# EAGLE schematic urdevboard (EAGLE 5.06), part 1 of 2
POWER: 0.2W; VOLT: 25V

## Sheet 1 of 16
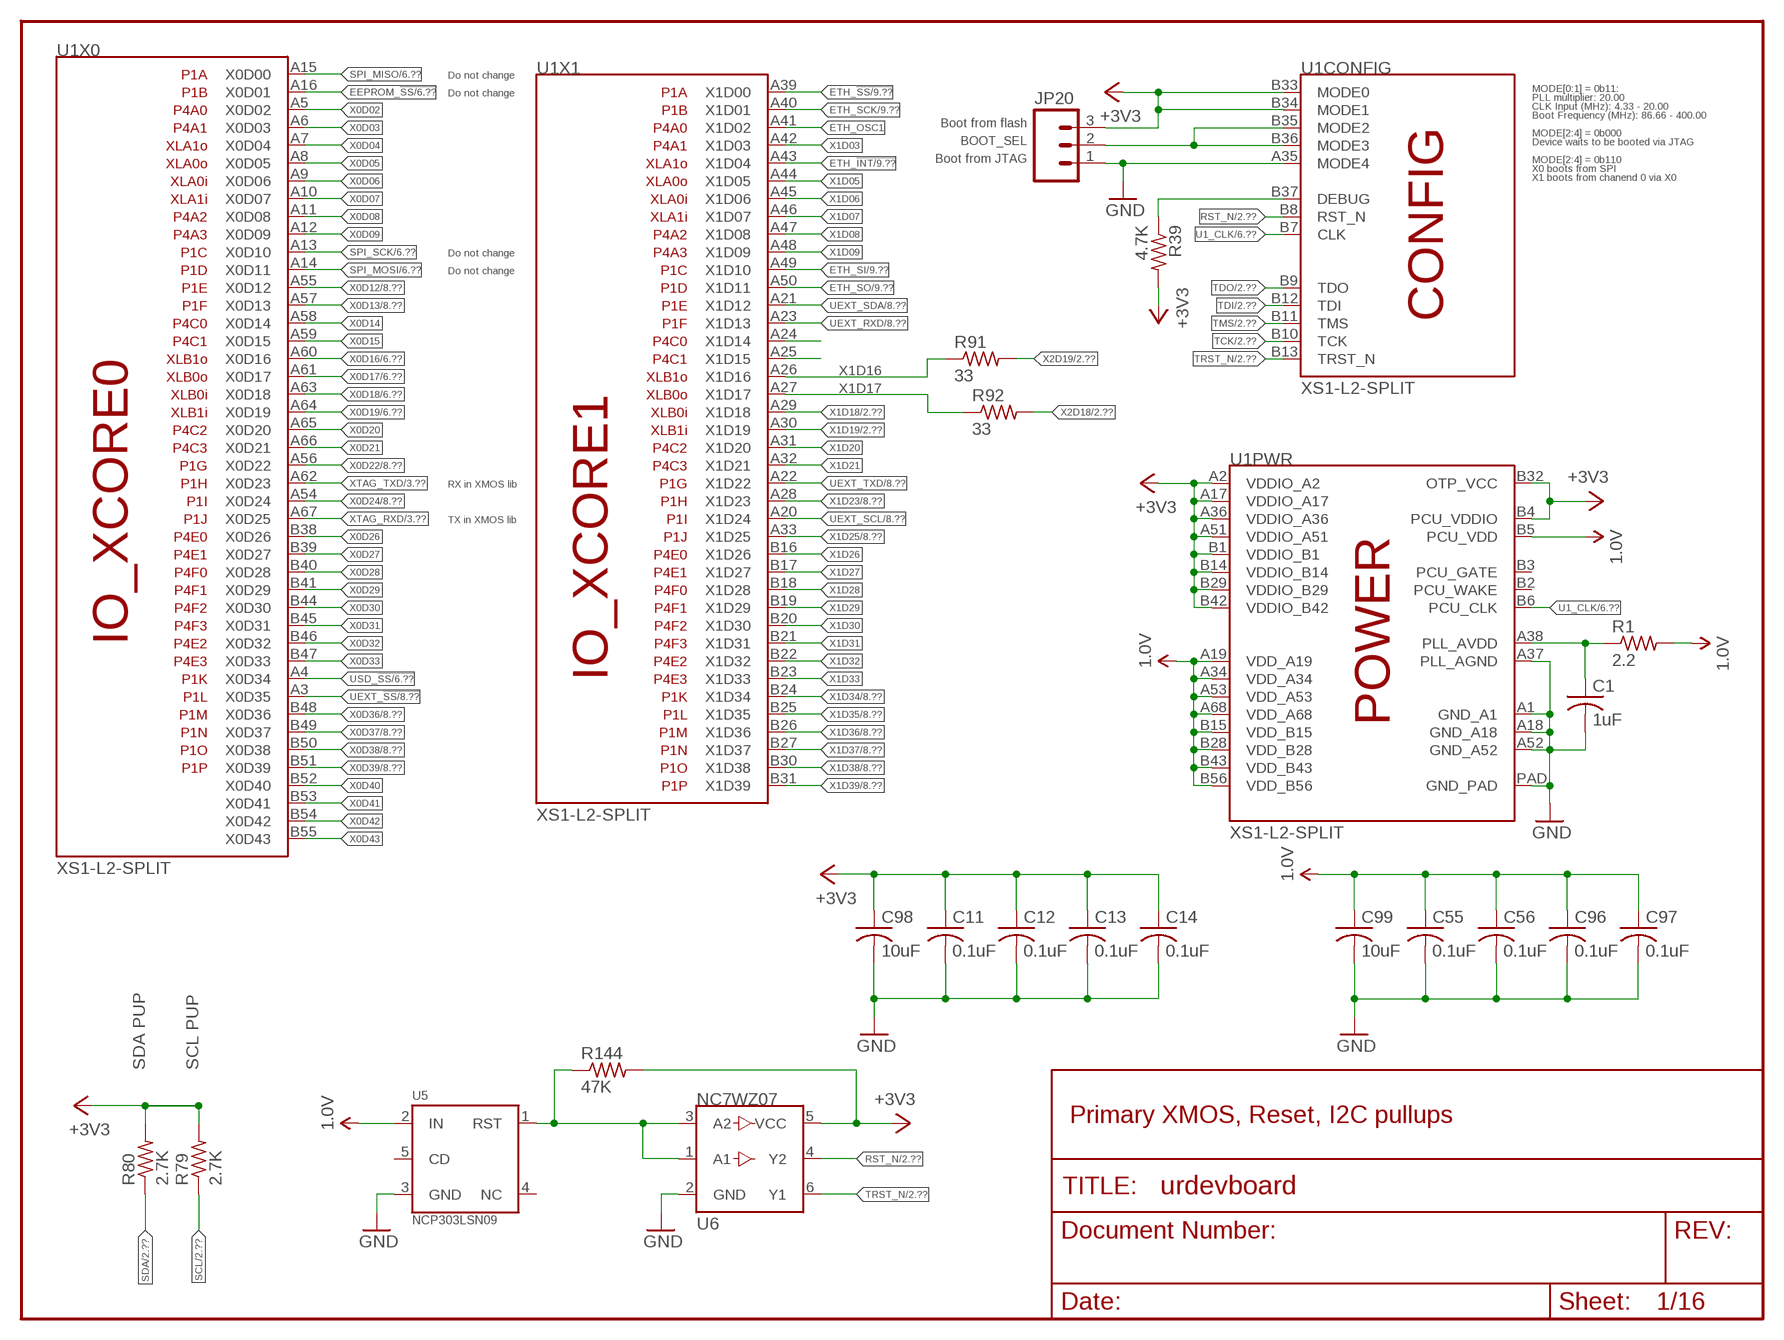
[diagram p0: schematic, sheet 1]

### Parts
C1  1uF  C-USC0402  [C0402]
C11  0.1uF  C-USC0402  [C0402]
C12  0.1uF  C-USC0402  [C0402]
C13  0.1uF  C-USC0402  [C0402]
C14  0.1uF  C-USC0402  [C0402]
C55  0.1uF  C-USC0402  [C0402]
C56  0.1uF  C-USC0402  [C0402]
C96  0.1uF  C-USC0402  [C0402]
C97  0.1uF  C-USC0402  [C0402]
C98  10uF  C-USC0805  [C0805]
C99  10uF  C-USC0805  [C0805]
JP20  M03PTH  [1X03]
R1  2.2  R-US_R0402  [R0402]
R39  4.7K  R-US_R0603  [R0603]
R79  2.7K  R-US_R0603  [R0603]
R80  2.7K  R-US_R0603  [R0603]
R91  33  R-US_R0402  [R0402]
R92  33  R-US_R0402  [R0402]
R144  47K  R-US_R0402  [R0402]
U1  XS1-L2-SPLIT  [124QFN]
U5  NCP303LSN09  [SOT23-5]
U6  NC7WZ07  [SC70-6]

### Nets
1.0V: C55.1 C56.1 C96.1 C97.1 C99.1 R1.2 U1.A19(PWR:VDD_A19) U1.A34(PWR:VDD_A34) U1.A53(PWR:VDD_A53) U1.A68(PWR:VDD_A68) U1.B5(PWR:PCU_VDD) U1.B15(PWR:VDD_B15) U1.B28(PWR:VDD_B28) U1.B43(PWR:VDD_B43) U1.B56(PWR:VDD_B56) U5.2(IN) ; also sheet 2,7
+3V3: C11.1 C12.1 C13.1 C14.1 C98.1 JP20.3 R39.2 R79.2 R80.2 R144.2 U1.A2(PWR:VDDIO_A2) U1.A17(PWR:VDDIO_A17) U1.A36(PWR:VDDIO_A36) U1.A51(PWR:VDDIO_A51) U1.B1(PWR:VDDIO_B1) U1.B4(PWR:PCU_VDDIO) U1.B14(PWR:VDDIO_B14) U1.B29(PWR:VDDIO_B29) U1.B32(PWR:OTP_VCC) U1.B33(CONFIG:MODE0) U1.B34(CONFIG:MODE1) U1.B42(PWR:VDDIO_B42) U6.5(VCC) ; also sheet 2,3,4,5,6,7,8,9,10,11,16
BOOT_SEL: JP20.2 U1.B35(CONFIG:MODE2) U1.B36(CONFIG:MODE3)
DEBUG_N: R39.1 U1.B37(CONFIG:DEBUG) ; also sheet 2,3,6
EEPROM_!SS: U1.A16(X0:X0D01) ; also sheet 6
ETH_!INT: U1.A43(X1:X1D04) ; also sheet 9
ETH_!SS: U1.A39(X1:X1D00) ; also sheet 9
ETH_OSC1: U1.A41(X1:X1D02) ; also sheet 9
ETH_SCK: U1.A40(X1:X1D01) ; also sheet 9
ETH_SI: U1.A49(X1:X1D10) ; also sheet 9
ETH_SO: U1.A50(X1:X1D11) ; also sheet 9
GND: C1.2 C11.2 C12.2 C13.2 C14.2 C55.2 C56.2 C96.2 C97.2 C98.2 C99.2 JP20.1 U1.A1(PWR:GND_A1) U1.A18(PWR:GND_A18) U1.A35(CONFIG:MODE4) U1.A37(PWR:PLL_AGND) U1.A52(PWR:GND_A52) U1.PAD(PWR:GND_PAD) U5.3(GND) U6.2(GND) ; also sheet 2,3,4,5,6,7,8,9,10,11,12,13,14,15,16
RST_N: U1.B8(CONFIG:RST_N) U6.4(Y2) ; also sheet 2,3,6
RST_OUT: R144.1 U5.1(RST) U6.1(A1) U6.3(A2)
SCL: R79.1 ; also sheet 2,8,11
SDA: R80.1 ; also sheet 2,8,11
SPI_MISO: U1.A15(X0:X0D00) ; also sheet 6,8
SPI_MOSI: U1.A14(X0:X0D11) ; also sheet 6,8
SPI_SCK: U1.A13(X0:X0D10) ; also sheet 6,8
TCK: U1.B10(CONFIG:TCK) ; also sheet 2,3,6
TDI: U1.B12(CONFIG:TDI) ; also sheet 2,3,6
TDO: U1.B9(CONFIG:TDO) ; also sheet 2,3,6
TMS: U1.B11(CONFIG:TMS) ; also sheet 2,3,6
TRST_N: U1.B13(CONFIG:TRST_N) U6.6(Y1) ; also sheet 2,3,6
U1_CLK: U1.B6(PWR:PCU_CLK) U1.B7(CONFIG:CLK) ; also sheet 6
U1_PLL_AVDD: C1.1 R1.1 U1.A38(PWR:PLL_AVDD)
UEXT_!SS: U1.A3(X0:X0D35) ; also sheet 8
UEXT_RXD: U1.A23(X1:X1D13) ; also sheet 8
UEXT_SCL: U1.A20(X1:X1D24) ; also sheet 8
UEXT_SDA: U1.A21(X1:X1D12) ; also sheet 8
UEXT_TXD: U1.A22(X1:X1D22) ; also sheet 8
USD_!SS: U1.A4(X0:X0D34) ; also sheet 6
X0D02: U1.A5(X0:X0D02)
X0D03: U1.A6(X0:X0D03)
X0D04: U1.A7(X0:X0D04)
X0D05: U1.A8(X0:X0D05)
X0D06: U1.A9(X0:X0D06)
X0D07: U1.A10(X0:X0D07)
X0D08: U1.A11(X0:X0D08)
X0D09: U1.A12(X0:X0D09)
X0D12: U1.A55(X0:X0D12) ; also sheet 8
X0D13: U1.A57(X0:X0D13) ; also sheet 8
X0D14: U1.A58(X0:X0D14)
X0D15: U1.A59(X0:X0D15)
X0D16: U1.A60(X0:X0D16) ; also sheet 6
X0D17: U1.A61(X0:X0D17) ; also sheet 6
X0D18: U1.A63(X0:X0D18) ; also sheet 6
X0D19: U1.A64(X0:X0D19) ; also sheet 6
X0D20: U1.A65(X0:X0D20)
X0D21: U1.A66(X0:X0D21)
X0D22: U1.A56(X0:X0D22) ; also sheet 8
X0D24: U1.A54(X0:X0D24) ; also sheet 8
X0D26: U1.B38(X0:X0D26)
X0D27: U1.B39(X0:X0D27)
X0D28: U1.B40(X0:X0D28)
X0D29: U1.B41(X0:X0D29)
X0D30: U1.B44(X0:X0D30)
X0D31: U1.B45(X0:X0D31)
X0D32: U1.B46(X0:X0D32)
X0D33: U1.B47(X0:X0D33)
X0D36: U1.B48(X0:X0D36) ; also sheet 8
X0D37: U1.B49(X0:X0D37) ; also sheet 8
X0D38: U1.B50(X0:X0D38) ; also sheet 8
X0D39: U1.B51(X0:X0D39) ; also sheet 8
X0D40: U1.B52(X0:X0D40)
X0D41: U1.B53(X0:X0D41)
X0D42: U1.B54(X0:X0D42)
X0D43: U1.B55(X0:X0D43)
X1D03: U1.A42(X1:X1D03)
X1D05: U1.A44(X1:X1D05)
X1D06: U1.A45(X1:X1D06)
X1D07: U1.A46(X1:X1D07)
X1D08: U1.A47(X1:X1D08)
X1D09: U1.A48(X1:X1D09)
X1D14: U1.A24(X1:X1D14)
X1D15: U1.A25(X1:X1D15)
X1D16: R91.1 U1.A26(X1:X1D16)
X1D17: R92.1 U1.A27(X1:X1D17)
X1D18: U1.A29(X1:X1D18) ; also sheet 2
X1D19: U1.A30(X1:X1D19) ; also sheet 2
X1D20: U1.A31(X1:X1D20)
X1D21: U1.A32(X1:X1D21)
X1D23: U1.A28(X1:X1D23) ; also sheet 8
X1D25: U1.A33(X1:X1D25) ; also sheet 8
X1D26: U1.B16(X1:X1D26)
X1D27: U1.B17(X1:X1D27)
X1D28: U1.B18(X1:X1D28)
X1D29: U1.B19(X1:X1D29)
X1D30: U1.B20(X1:X1D30)
X1D31: U1.B21(X1:X1D31)
X1D32: U1.B22(X1:X1D32)
X1D33: U1.B23(X1:X1D33)
X1D34: U1.B24(X1:X1D34) ; also sheet 8
X1D35: U1.B25(X1:X1D35) ; also sheet 8
X1D36: U1.B26(X1:X1D36) ; also sheet 8
X1D37: U1.B27(X1:X1D37) ; also sheet 8
X1D38: U1.B30(X1:X1D38) ; also sheet 8
X1D39: U1.B31(X1:X1D39) ; also sheet 8
X2D18: R92.2 ; also sheet 2
X2D19: R91.2 ; also sheet 2
XTAG_RXD: U1.A67(X0:X0D25) ; also sheet 3
XTAG_TXD: U1.A62(X0:X0D23) ; also sheet 3
Unconnected: U1.B2(PWR:PCU_WAKE) U1.B3(PWR:PCU_GATE) U5.4(NC) U5.5(CD)

### Notes on the sheet
- P1A
- Do not change
- P1B | P1A
- MODE[0:1] = 0b11:
- Do not change
- PLL multiplier: 20.00
- P4A0 | P1B
- CLK Input (MHz): 4.33 - 20.00
- Boot Frequency (MHz): 86.66 - 400.00
- P4A1 | P4A0
- Boot from flash
- MODE[2:4] = 0b000
- XLA1o | P4A1
- Device waits to be booted via JTAG
- XLA0o | XLA1o
- Boot from JTAG | MODE[2:4] = 0b110
- X0 boots from SPI
- XLA0i | XLA0o
- X1 boots from chanend 0 via X0
- XLA1i | XLA0i
- P4A2 | XLA1i
- P4A3 | P4A2
- P1C | P4A3
- Do not change
- P1D | P1C
- Do not change
- P1E | P1D
- P1F | P1E
- P4C0 | P1F
- P4C1 | P4C0
- XLB1o | P4C1
- XLB0o | XLB1o
- XLB0i | XLB0o
- XLB1i | XLB0i
- P4C2 | XLB1i
- P4C3 | P4C2
- P1G | P4C3
- P1H | P1G
- RX in XMOS lib
- P1I | P1H
- P1J | P1I
- TX in XMOS lib
- P4E0 | P1J
- P4E1 | P4E0
- P4F0 | P4E1
- P4F1 | P4F0
- P4F2 | P4F1
- P4F3 | P4F2
- P4E2 | P4F3
- P4E3 | P4E2
- P1K | P4E3
- P1L | P1K
- P1M | P1L
- P1N | P1M
- P1O | P1N
- P1P | P1O
- P1P
- SDA PUP | SCL PUP
- Primary XMOS, Reset, I2C pullups

## Sheet 2 of 16
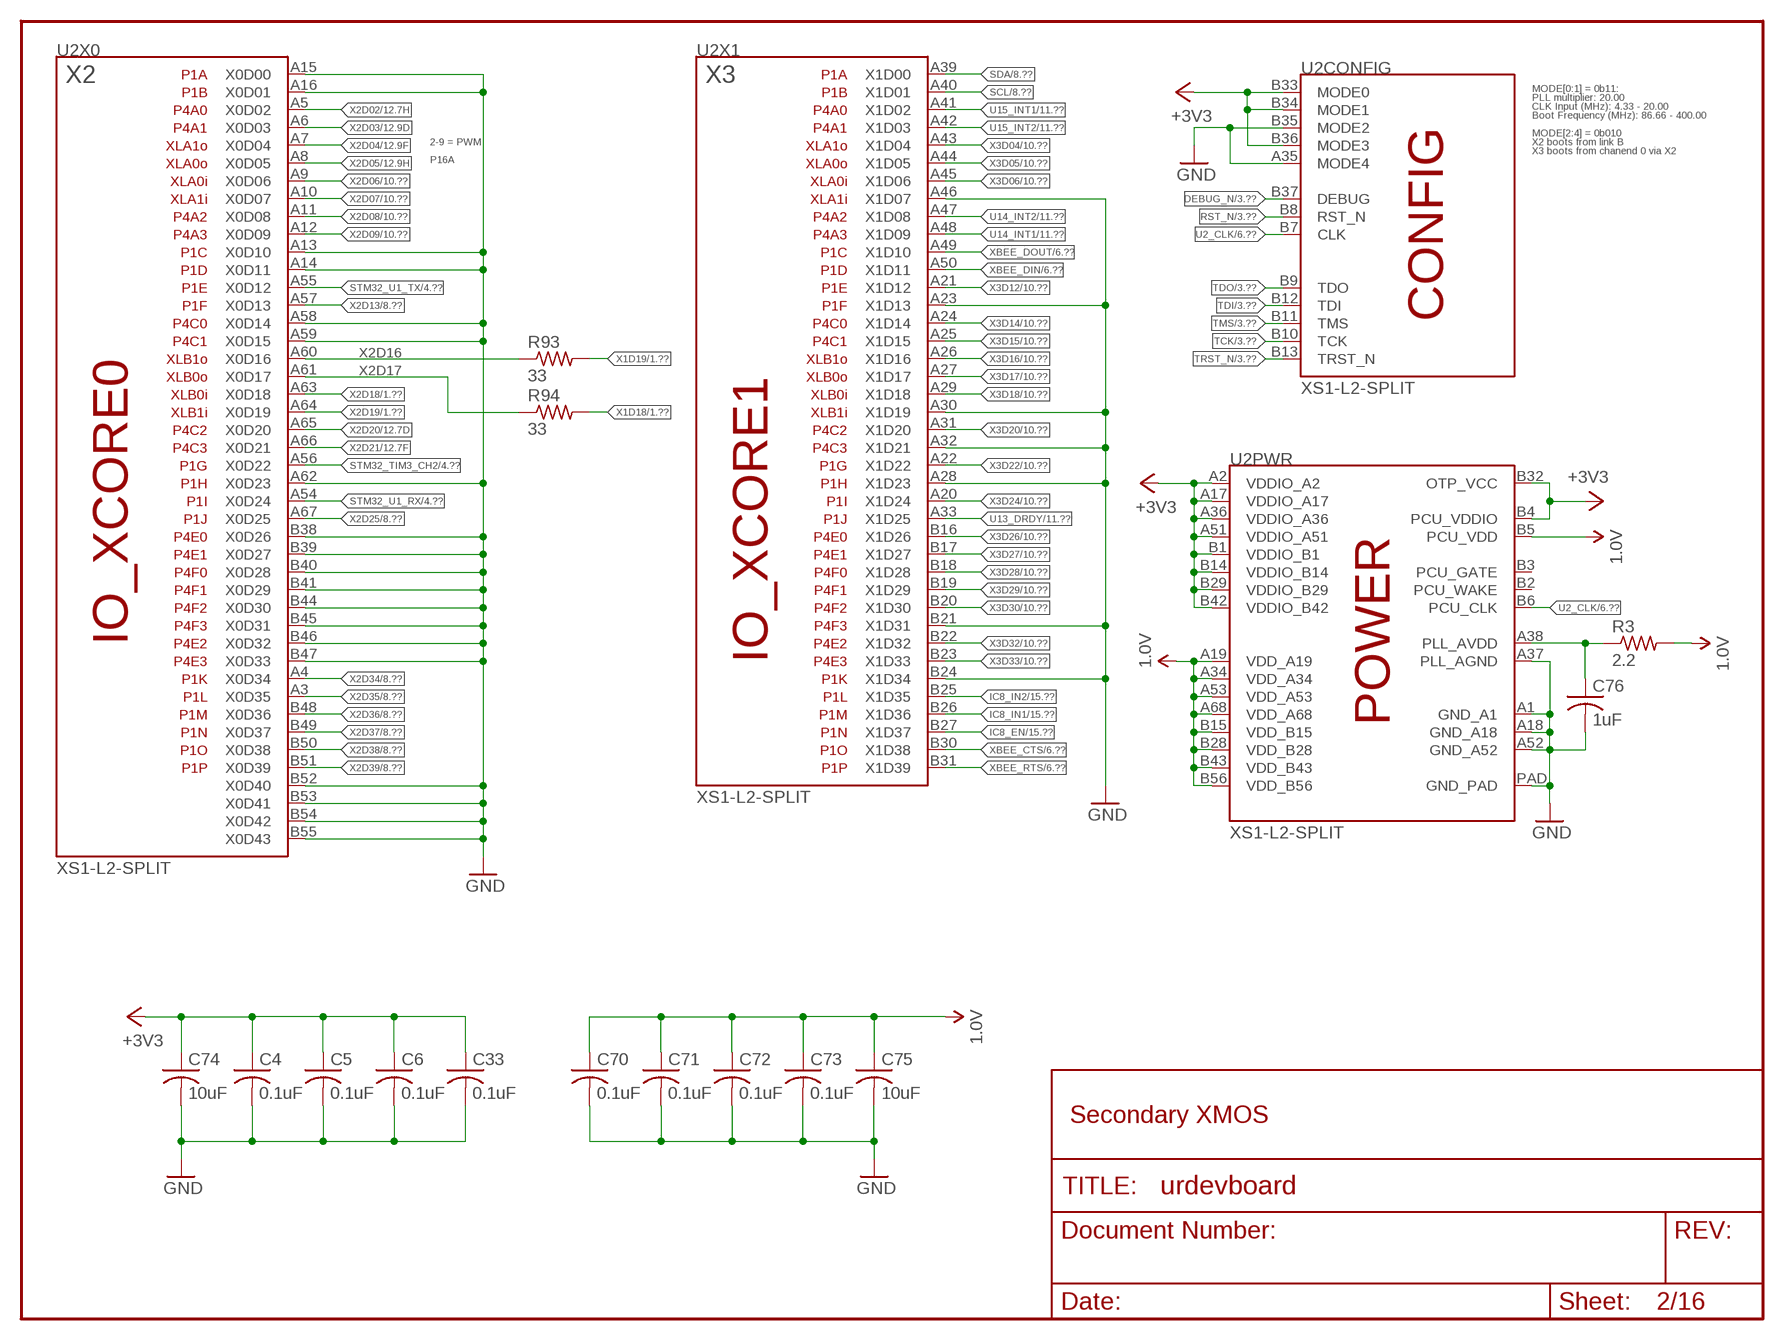
[diagram p1: schematic, sheet 2]

### Parts
C4  0.1uF  C-USC0402  [C0402]
C5  0.1uF  C-USC0402  [C0402]
C6  0.1uF  C-USC0402  [C0402]
C33  0.1uF  C-USC0402  [C0402]
C70  0.1uF  C-USC0402  [C0402]
C71  0.1uF  C-USC0402  [C0402]
C72  0.1uF  C-USC0402  [C0402]
C73  0.1uF  C-USC0402  [C0402]
C74  10uF  C-USC0805  [C0805]
C75  10uF  C-USC0805  [C0805]
C76  1uF  C-USC0402  [C0402]
R3  2.2  R-US_R0402  [R0402]
R93  33  R-US_R0402  [R0402]
R94  33  R-US_R0402  [R0402]
U2  XS1-L2-SPLIT  [124QFN]

### Nets
1.0V: C70.1 C71.1 C72.1 C73.1 C75.1 R3.2 U2.A19(PWR:VDD_A19) U2.A34(PWR:VDD_A34) U2.A53(PWR:VDD_A53) U2.A68(PWR:VDD_A68) U2.B5(PWR:PCU_VDD) U2.B15(PWR:VDD_B15) U2.B28(PWR:VDD_B28) U2.B43(PWR:VDD_B43) U2.B56(PWR:VDD_B56) ; also sheet 1,7
+3V3: C4.1 C5.1 C6.1 C33.1 C74.1 U2.A2(PWR:VDDIO_A2) U2.A17(PWR:VDDIO_A17) U2.A36(PWR:VDDIO_A36) U2.A51(PWR:VDDIO_A51) U2.B1(PWR:VDDIO_B1) U2.B4(PWR:PCU_VDDIO) U2.B14(PWR:VDDIO_B14) U2.B29(PWR:VDDIO_B29) U2.B32(PWR:OTP_VCC) U2.B33(CONFIG:MODE0) U2.B34(CONFIG:MODE1) U2.B36(CONFIG:MODE3) U2.B42(PWR:VDDIO_B42) ; also sheet 1,3,4,5,6,7,8,9,10,11,16
DEBUG_N: U2.B37(CONFIG:DEBUG) ; also sheet 1,3,6
GND: C4.2 C5.2 C6.2 C33.2 C70.2 C71.2 C72.2 C73.2 C74.2 C75.2 C76.2 U2.A1(PWR:GND_A1) U2.A13(X0:X0D10) U2.A14(X0:X0D11) U2.A15(X0:X0D00) U2.A16(X0:X0D01) U2.A18(PWR:GND_A18) U2.A23(X1:X1D13) U2.A28(X1:X1D23) U2.A30(X1:X1D19) U2.A32(X1:X1D21) U2.A35(CONFIG:MODE4) U2.A37(PWR:PLL_AGND) U2.A46(X1:X1D07) U2.A52(PWR:GND_A52) U2.A58(X0:X0D14) U2.A59(X0:X0D15) U2.A62(X0:X0D23) U2.B21(X1:X1D31) U2.B24(X1:X1D34) U2.B35(CONFIG:MODE2) U2.B38(X0:X0D26) U2.B39(X0:X0D27) U2.B40(X0:X0D28) U2.B41(X0:X0D29) U2.B44(X0:X0D30) U2.B45(X0:X0D31) U2.B46(X0:X0D32) U2.B47(X0:X0D33) U2.B52(X0:X0D40) U2.B53(X0:X0D41) U2.B54(X0:X0D42) U2.B55(X0:X0D43) U2.PAD(PWR:GND_PAD) ; also sheet 1,3,4,5,6,7,8,9,10,11,12,13,14,15,16
IC8_EN: U2.B27(X1:X1D37) ; also sheet 15
IC8_IN1: U2.B26(X1:X1D36) ; also sheet 15
IC8_IN2: U2.B25(X1:X1D35) ; also sheet 15
RST_N: U2.B8(CONFIG:RST_N) ; also sheet 1,3,6
SCL: U2.A40(X1:X1D01) ; also sheet 1,8,11
SDA: U2.A39(X1:X1D00) ; also sheet 1,8,11
STM32_TIM3_CH2: U2.A56(X0:X0D22) ; also sheet 4
STM32_U1_RX: U2.A54(X0:X0D24) ; also sheet 4
STM32_U1_TX: U2.A55(X0:X0D12) ; also sheet 4
TCK: U2.B10(CONFIG:TCK) ; also sheet 1,3,6
TDI: U2.B12(CONFIG:TDI) ; also sheet 1,3,6
TDO: U2.B9(CONFIG:TDO) ; also sheet 1,3,6
TMS: U2.B11(CONFIG:TMS) ; also sheet 1,3,6
TRST_N: U2.B13(CONFIG:TRST_N) ; also sheet 1,3,6
U2_CLK: U2.B6(PWR:PCU_CLK) U2.B7(CONFIG:CLK) ; also sheet 6
U2_PLL_AVDD: C76.1 R3.1 U2.A38(PWR:PLL_AVDD)
U13_DRDY: U2.A33(X1:X1D25) ; also sheet 11
U14_INT1: U2.A48(X1:X1D09) ; also sheet 11
U14_INT2: U2.A47(X1:X1D08) ; also sheet 11
U15_INT1: U2.A41(X1:X1D02) ; also sheet 11
U15_INT2: U2.A42(X1:X1D03) ; also sheet 11
X1D18: R94.2 ; also sheet 1
X1D19: R93.2 ; also sheet 1
X2D02: U2.A5(X0:X0D02) ; also sheet 12
X2D03: U2.A6(X0:X0D03) ; also sheet 12
X2D04: U2.A7(X0:X0D04) ; also sheet 12
X2D05: U2.A8(X0:X0D05) ; also sheet 12
X2D06: U2.A9(X0:X0D06) ; also sheet 10
X2D07: U2.A10(X0:X0D07) ; also sheet 10
X2D08: U2.A11(X0:X0D08) ; also sheet 10
X2D09: U2.A12(X0:X0D09) ; also sheet 10
X2D13: U2.A57(X0:X0D13) ; also sheet 8
X2D16: R93.1 U2.A60(X0:X0D16)
X2D17: R94.1 U2.A61(X0:X0D17)
X2D18: U2.A63(X0:X0D18) ; also sheet 1
X2D19: U2.A64(X0:X0D19) ; also sheet 1
X2D20: U2.A65(X0:X0D20) ; also sheet 12
X2D21: U2.A66(X0:X0D21) ; also sheet 12
X2D25: U2.A67(X0:X0D25) ; also sheet 8
X2D34: U2.A4(X0:X0D34) ; also sheet 8
X2D35: U2.A3(X0:X0D35) ; also sheet 8
X2D36: U2.B48(X0:X0D36) ; also sheet 8
X2D37: U2.B49(X0:X0D37) ; also sheet 8
X2D38: U2.B50(X0:X0D38) ; also sheet 8
X2D39: U2.B51(X0:X0D39) ; also sheet 8
X3D04: U2.A43(X1:X1D04) ; also sheet 10
X3D05: U2.A44(X1:X1D05) ; also sheet 10
X3D06: U2.A45(X1:X1D06) ; also sheet 10
X3D12: U2.A21(X1:X1D12) ; also sheet 10
X3D14: U2.A24(X1:X1D14) ; also sheet 10
X3D15: U2.A25(X1:X1D15) ; also sheet 10
X3D16: U2.A26(X1:X1D16) ; also sheet 10
X3D17: U2.A27(X1:X1D17) ; also sheet 10
X3D18: U2.A29(X1:X1D18) ; also sheet 10
X3D20: U2.A31(X1:X1D20) ; also sheet 10
X3D22: U2.A22(X1:X1D22) ; also sheet 10
X3D24: U2.A20(X1:X1D24) ; also sheet 10
X3D26: U2.B16(X1:X1D26) ; also sheet 10
X3D27: U2.B17(X1:X1D27) ; also sheet 10
X3D28: U2.B18(X1:X1D28) ; also sheet 10
X3D29: U2.B19(X1:X1D29) ; also sheet 10
X3D30: U2.B20(X1:X1D30) ; also sheet 10
X3D32: U2.B22(X1:X1D32) ; also sheet 10
X3D33: U2.B23(X1:X1D33) ; also sheet 10
XBEE_CTS: U2.B30(X1:X1D38) ; also sheet 6
XBEE_DIN: U2.A50(X1:X1D11) ; also sheet 6
XBEE_DOUT: U2.A49(X1:X1D10) ; also sheet 6
XBEE_RTS: U2.B31(X1:X1D39) ; also sheet 6
Unconnected: U2.B2(PWR:PCU_WAKE) U2.B3(PWR:PCU_GATE)

### Notes on the sheet
- P1A | P1A
- X2 | X3
- P1B | P1B
- MODE[0:1] = 0b11:
- PLL multiplier: 20.00
- P4A0 | P4A0
- CLK Input (MHz): 4.33 - 20.00
- Boot Frequency (MHz): 86.66 - 400.00
- P4A1 | P4A1
- MODE[2:4] = 0b010
- XLA1o | XLA1o
- 2-9 = PWM | X2 boots from link B
- X3 boots from chanend 0 via X2
- XLA0o | XLA0o
- P16A
- XLA0i | XLA0i
- XLA1i | XLA1i
- P4A2 | P4A2
- P4A3 | P4A3
- P1C | P1C
- P1D | P1D
- P1E | P1E
- P1F | P1F
- P4C0 | P4C0
- P4C1 | P4C1
- XLB1o | XLB1o
- XLB0o | XLB0o
- XLB0i | XLB0i
- XLB1i | XLB1i
- P4C2 | P4C2
- P4C3 | P4C3
- P1G | P1G
- P1H | P1H
- P1I | P1I
- P1J | P1J
- P4E0 | P4E0
- P4E1 | P4E1
- P4F0 | P4F0
- P4F1 | P4F1
- P4F2 | P4F2
- P4F3 | P4F3
- P4E2 | P4E2
- P4E3 | P4E3
- P1K | P1K
- P1L | P1L
- P1M | P1M
- P1N | P1N
- P1O | P1O
- P1P | P1P
- Secondary XMOS

## Sheet 3 of 16
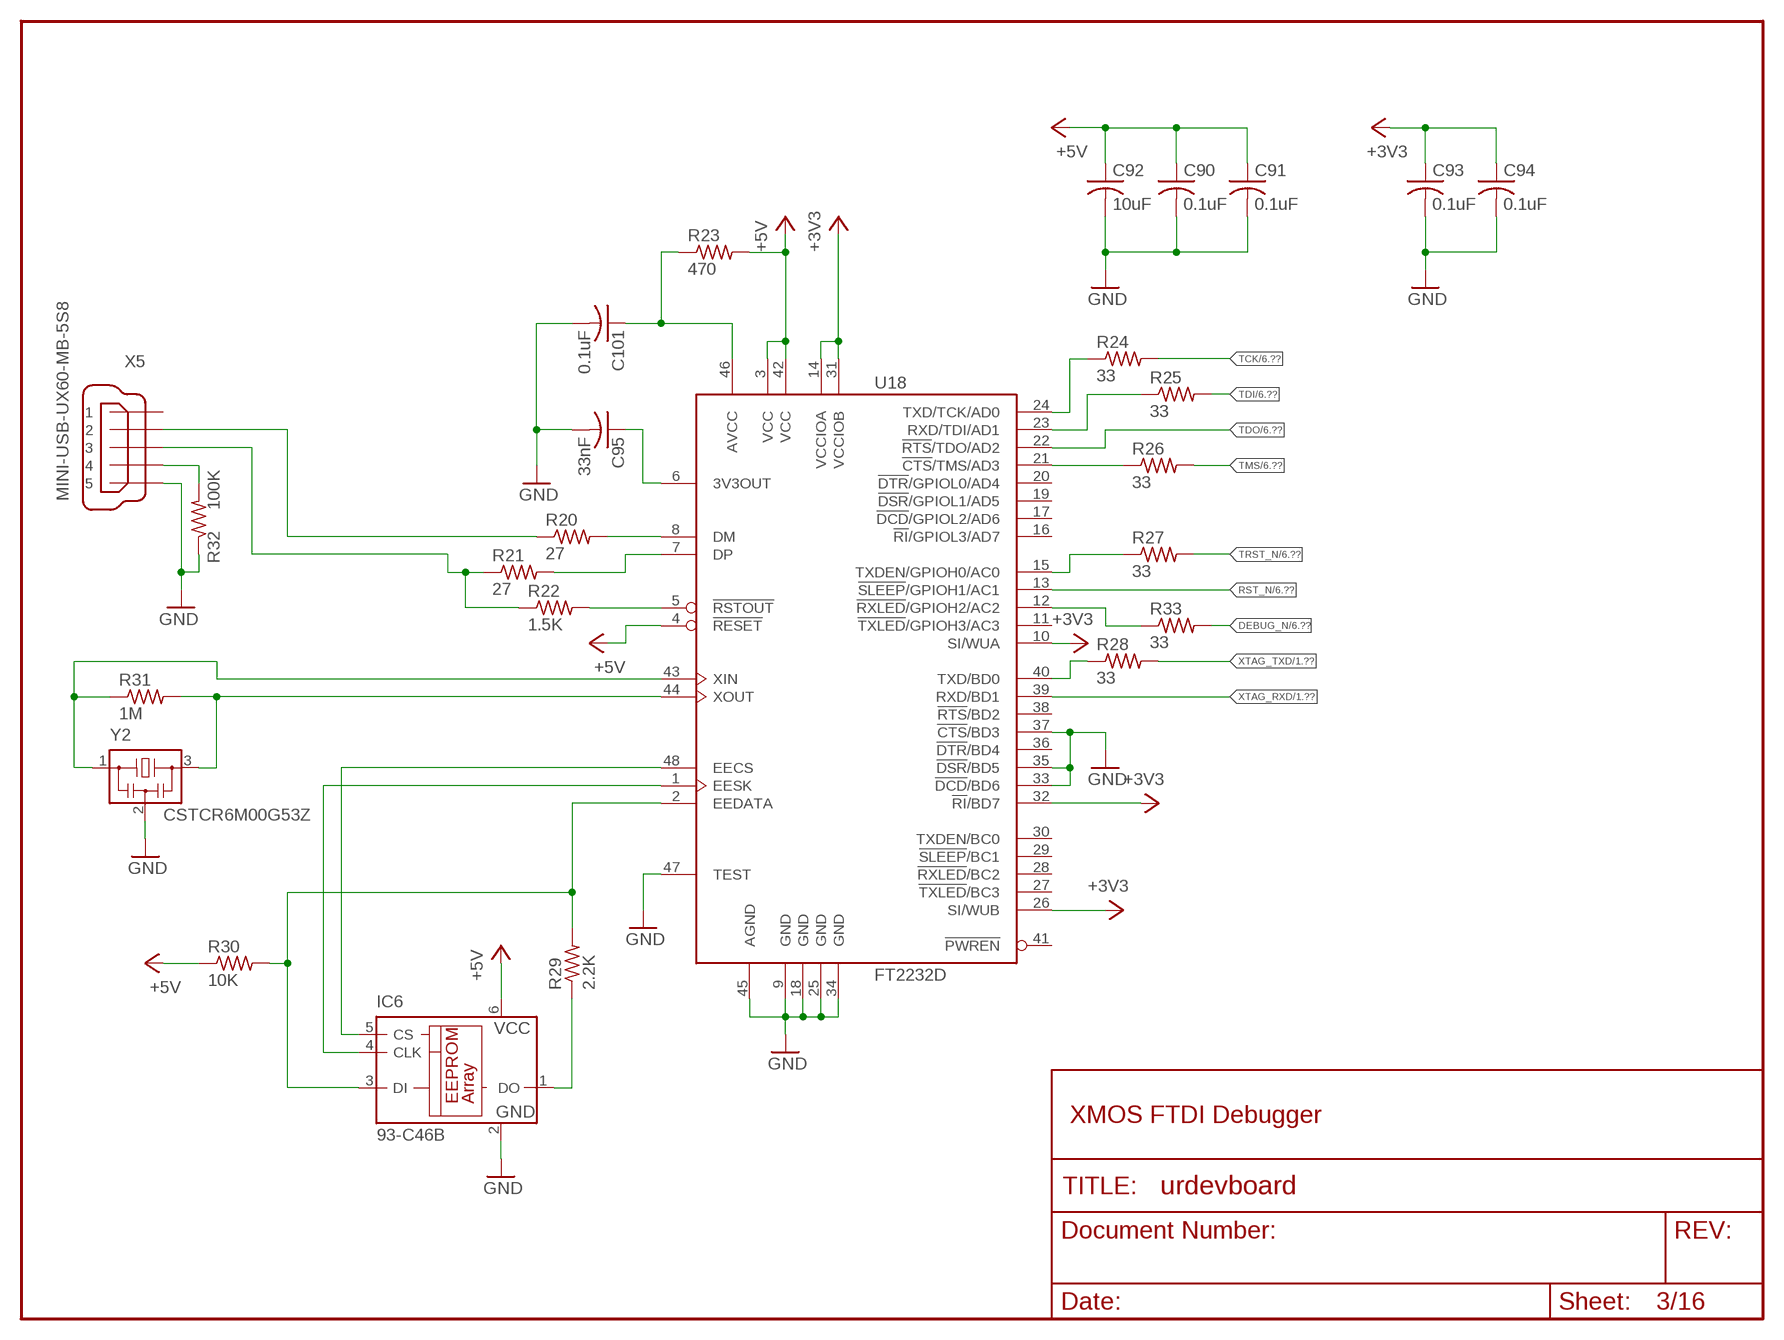
[diagram p2: schematic, sheet 3]

### Parts
C90  0.1uF  C-USC0402  [C0402]
C91  0.1uF  C-USC0402  [C0402]
C92  10uF  C-USC0805  [C0805]
C93  0.1uF  C-USC0402  [C0402]
C94  0.1uF  C-USC0402  [C0402]
C95  33nF  C-USC0603  [C0603]
C101  0.1uF  C-USC0402  [C0402]
IC6  93-C46B  [SOT23-6]
R20  27  R-US_R0402  [R0402]
R21  27  R-US_R0402  [R0402]
R22  1.5K  R-US_R0402  [R0402]
R23  470  R-US_R0603  [R0603]
R24  33  R-US_R0402  [R0402]
R25  33  R-US_R0402  [R0402]
R26  33  R-US_R0402  [R0402]
R27  33  R-US_R0402  [R0402]
R28  33  R-US_R0402  [R0402]
R29  2.2K  R-US_R0402  [R0402]
R30  10K  R-US_R0603  [R0603]
R31  1M  R-US_R0603  [R0603]
R32  100K  R-US_R0402  [R0402]
R33  33  R-US_R0402  [R0402]
U18  FT2232D  [PQFP48]
X5  MINI-USB-UX60-MB-5S8  [UX60-MB-5S8]
Y2  CSTCR6M00G53Z  [CSTCR6M]

### Nets
+3V3: C93.1 C94.1 U18.10(SI/WUA) U18.14(VCCIOA) U18.26(SI/WUB) U18.31(VCCIOB) U18.32(!RI!/BD7) ; also sheet 1,2,4,5,6,7,8,9,10,11,16
+5V: C90.1 C91.1 C92.1 IC6.6(VCC) R23.2 R30.1 U18.3(VCC) U18.4(!RESET) U18.42(VCC) ; also sheet 4,6,7,8,10,12,13,14,15
DEBUG_N: R33.2 ; also sheet 1,2,6
GND: C90.2 C91.2 C92.2 C93.2 C94.2 C95.2 C101.2 IC6.2(GND) R32.1 U18.9(GND) U18.18(GND) U18.25(GND) U18.33(!DCD!/BD6) U18.34(GND) U18.35(!DSR!/BD5) U18.37(!CTS!/BD3) U18.45(AGND) U18.47(TEST) X5.5 Y2.2 ; also sheet 1,2,4,5,6,7,8,9,10,11,12,13,14,15,16
IC6_DO: IC6.1(DO) R29.1
RST_N: U18.13(!SLEEP!/GPIOH1/AC1) ; also sheet 1,2,6
TCK: R24.2 ; also sheet 1,2,6
TDI: R25.2 ; also sheet 1,2,6
TDO: U18.22(!RTS!/TDO/AD2) ; also sheet 1,2,6
TMS: R26.2 ; also sheet 1,2,6
TRST_N: R27.2 ; also sheet 1,2,6
U18_3V3OUT: C95.1 U18.6(3V3OUT)
U18_12: R33.1 U18.12(!RXLED!/GPIOH2/AC2)
U18_15: R27.1 U18.15(TXDEN/GPIOH0/AC0)
U18_21: R26.1 U18.21(!CTS!/TMS/AD3)
U18_23: R25.1 U18.23(RXD/TDI/AD1)
U18_24: R24.1 U18.24(TXD/TCK/AD0)
U18_40: R28.1 U18.40(TXD/BD0)
U18_!RSTOUT: R22.2 U18.5(!RSTOUT)
U18_AVCC: C101.1 R23.1 U18.46(AVCC)
U18_DM: R20.2 U18.8(DM)
U18_DP: R21.2 U18.7(DP)
U18_EECS: IC6.5(CS) U18.48(EECS)
U18_EEDATA: IC6.3(DI) R29.2 R30.2 U18.2(EEDATA)
U18_EESK: IC6.4(CLK) U18.1(EESK)
U18_XIN: R31.1 U18.43(XIN) Y2.1
U18_XOUT: R31.2 U18.44(XOUT) Y2.3
X5_DM: R20.1 X5.2
X5_DP: R21.1 R22.1 X5.3
X5_ID: R32.2 X5.4
XTAG_RXD: U18.39(RXD/BD1) ; also sheet 1
XTAG_TXD: R28.2 ; also sheet 1
Unconnected: U18.11(!TXLED!/GPIOH3/AC3) U18.16(!RI!/GPIOL3/AD7) U18.17(!DCD!/GPIOL2/AD6) U18.19(!DSR!/GPIOL1/AD5) U18.20(!DTR!/GPIOL0/AD4) U18.27(!TXLED!/BC3) U18.28(!RXLED!/BC2) U18.29(!SLEEP!/BC1) U18.30(TXDEN/BC0) U18.36(!DTR!/BD4) U18.38(!RTS!/BD2) U18.41(!PWREN) X5.1

### Notes on the sheet
- XMOS FTDI Debugger

## Sheet 4 of 16
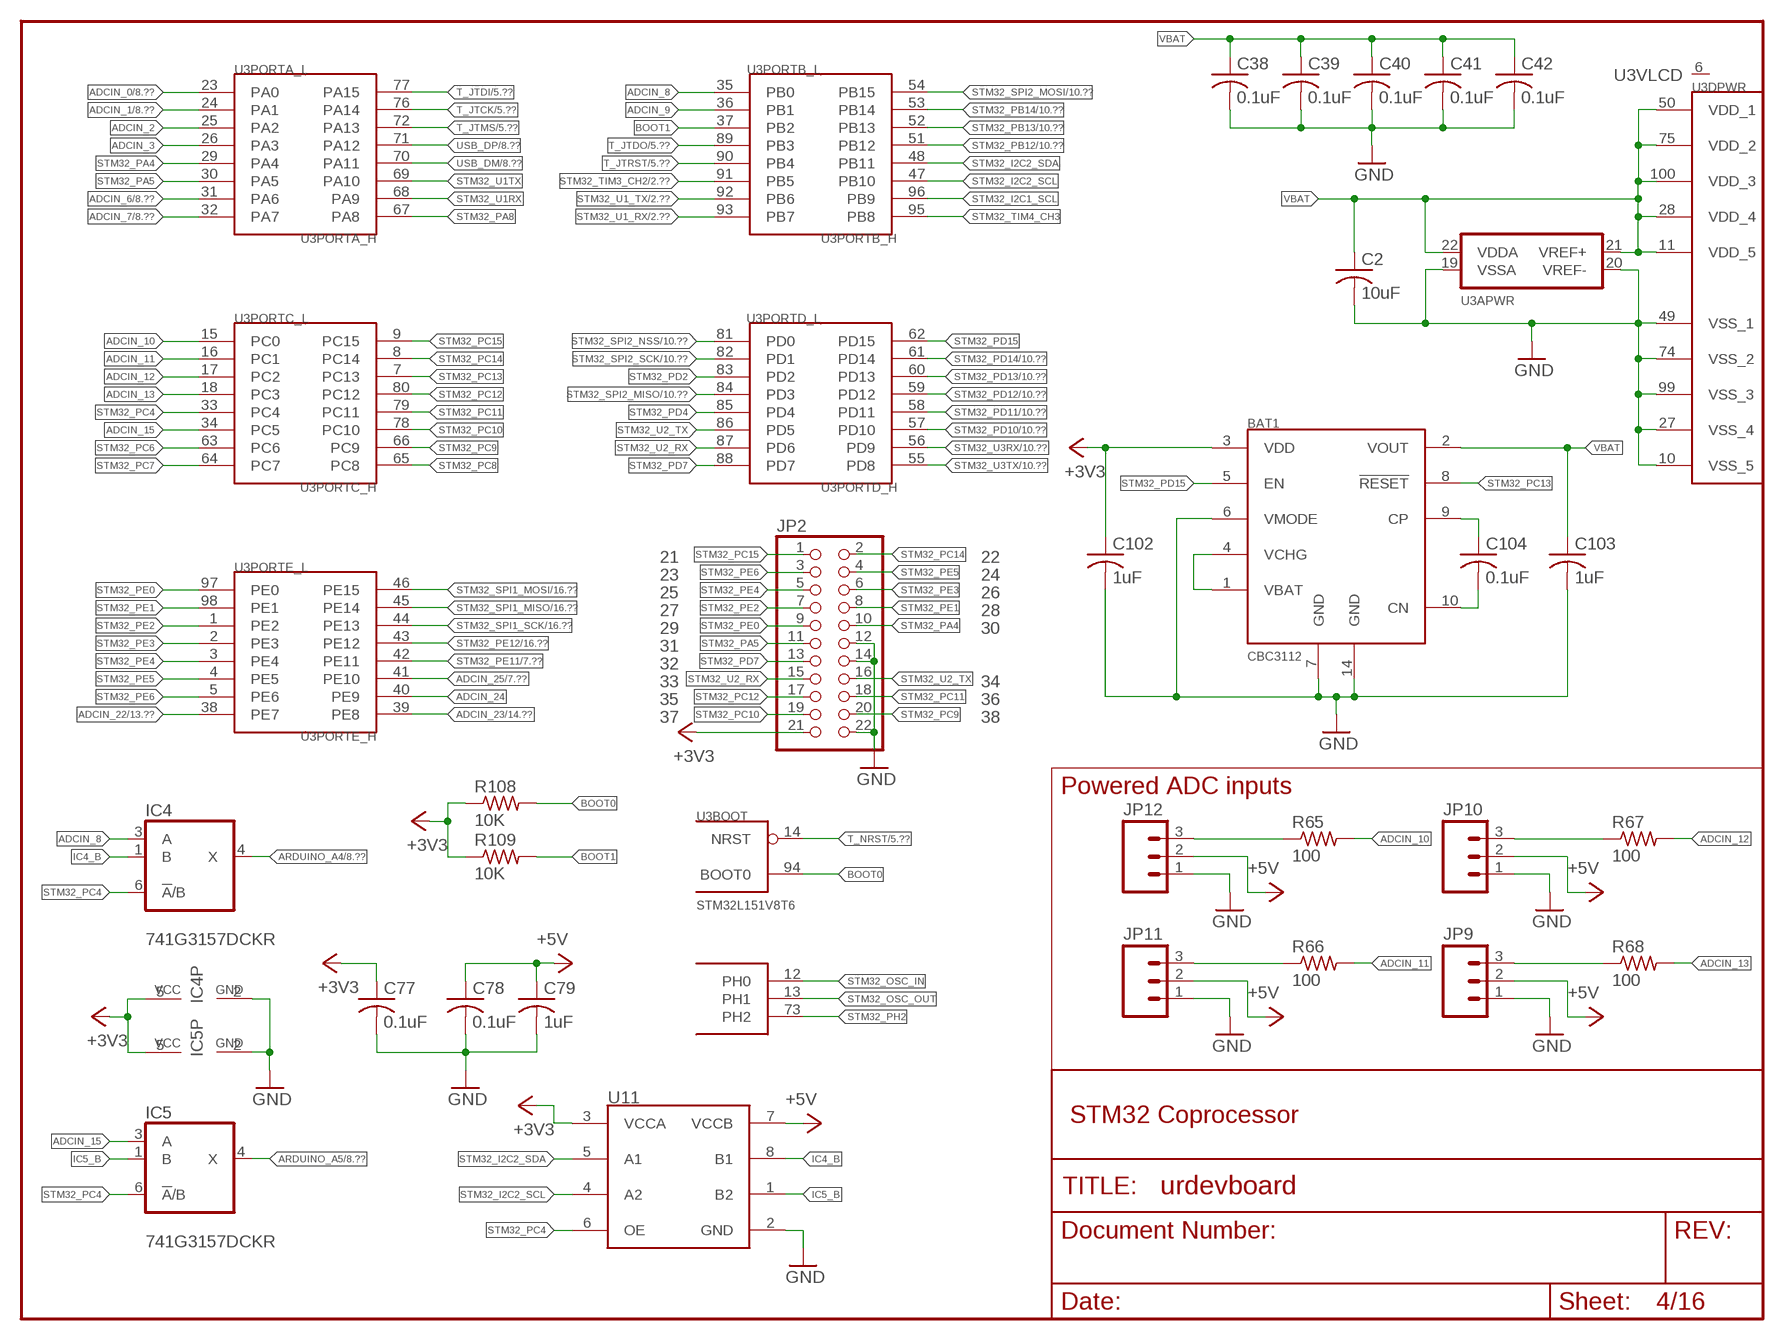
[diagram p3: schematic, sheet 4]

### Parts
BAT1  CBC3112  [D7C-DFN20]
C2  10uF  C-USC0805  [C0805]
C38  0.1uF  C-USC0603  [C0603]
C39  0.1uF  C-USC0603  [C0603]
C40  0.1uF  C-USC0603  [C0603]
C41  0.1uF  C-USC0603  [C0603]
C42  0.1uF  C-USC0603  [C0603]
C77  0.1uF  C-USC0402  [C0402]
C78  0.1uF  C-USC0402  [C0402]
C79  1uF  C-USC0402  [C0402]
C102  1uF  C-USC0402  [C0402]
C103  1uF  C-USC0402  [C0402]
C104  0.1uF  C-USC0402  [C0402]
IC4  741G3157DCKR  [DCK_R-PDSO-G6]
IC5  741G3157DCKR  [DCK_R-PDSO-G6]
JP2  PINHD-2X11  [2X11]
JP9  M03PTH  [1X03]
JP10  M03PTH  [1X03]
JP11  M03PTH  [1X03]
JP12  M03PTH  [1X03]
R65  100  R-US_R0402  [R0402]
R66  100  R-US_R0402  [R0402]
R67  100  R-US_R0402  [R0402]
R68  100  R-US_R0402  [R0402]
R108  10K  R-US_R0603  [R0603]
R109  10K  R-US_R0603  [R0603]
U3  STM32L151V8T6  STM32L15XVX  [LQFP100]
U11  TXS0102DCT  [DCT-R-PDSO-G8]

### Nets
+3V3: BAT1.3(VDD) C77.1 C102.1 IC4.5(VCC) IC5.5(VCC) JP2.21 R108.1 R109.1 U11.3(VCCA) ; also sheet 1,2,3,5,6,7,8,9,10,11,16
+5V: C78.1 C79.1 JP9.2 JP10.2 JP11.2 JP12.2 U11.7(VCCB) ; also sheet 3,6,7,8,10,12,13,14,15
ADCIN_0: U3.23(PORTA_L:PA0) ; also sheet 8
ADCIN_1: U3.24(PORTA_L:PA1) ; also sheet 8
ADCIN_2: U3.25(PORTA_L:PA2)
ADCIN_3: U3.26(PORTA_L:PA3)
ADCIN_6: U3.31(PORTA_L:PA6) ; also sheet 8
ADCIN_7: U3.32(PORTA_L:PA7) ; also sheet 8
ADCIN_8: IC4.3(A) U3.35(PORTB_L:PB0)
ADCIN_9: U3.36(PORTB_L:PB1) ; also sheet 15
ADCIN_10: R65.2 U3.15(PORTC_L:PC0)
ADCIN_11: R66.2 U3.16(PORTC_L:PC1)
ADCIN_12: R67.2 U3.17(PORTC_L:PC2)
ADCIN_13: R68.2 U3.18(PORTC_L:PC3)
ADCIN_15: IC5.3(A) U3.34(PORTC_L:PC5)
ADCIN_22: U3.38(PORTE_L:PE7) ; also sheet 13
ADCIN_23: U3.39(PORTE_H:PE8) ; also sheet 14
ADCIN_24: U3.40(PORTE_H:PE9) ; also sheet 15
ADCIN_25: U3.41(PORTE_H:PE10) ; also sheet 7
ARDUINO_A4: IC4.4(X) ; also sheet 8
ARDUINO_A5: IC5.4(X) ; also sheet 8
BAT1_CN: BAT1.10(CN) C104.2
BAT1_CP: BAT1.9(CP) C104.1
BAT1_VCHGBAT: BAT1.1(VBAT) BAT1.4(VCHG)
BOOT0: R108.2 U3.94(BOOT:BOOT0)
BOOT1: R109.2 U3.37(PORTB_L:PB2)
EXTERNAL_ADC_0: JP12.3 R65.1
EXTERNAL_ADC_1: JP11.3 R66.1
EXTERNAL_ADC_2: JP10.3 R67.1
EXTERNAL_ADC_3: JP9.3 R68.1
GND: BAT1.6(VMODE) BAT1.7(GND) BAT1.14(GND) C2.2 C38.2 C39.2 C40.2 C41.2 C42.2 C77.2 C78.2 C79.2 C102.2 C103.2 IC4.2(GND) IC5.2(GND) JP2.12 JP2.14 JP2.22 JP9.1 JP10.1 JP11.1 JP12.1 U3.10(DPWR:VSS_5) U3.19(APWR:VSSA) U3.20(APWR:VREF-) U3.27(DPWR:VSS_4) U3.49(DPWR:VSS_1) U3.74(DPWR:VSS_2) U3.99(DPWR:VSS_3) U11.2(GND) ; also sheet 1,2,3,5,6,7,8,9,10,11,12,13,14,15,16
IC4_B: IC4.1(B) U11.8(B1)
IC5_B: IC5.1(B) U11.1(B2)
STM32_I2C1_SCL: U3.96(PORTB_H:PB9)
STM32_I2C2_SCL: U3.47(PORTB_H:PB10) U11.4(A2)
STM32_I2C2_SDA: U3.48(PORTB_H:PB11) U11.5(A1)
STM32_OSC_IN: U3.12(PORTH:PH0)
STM32_OSC_OUT: U3.13(PORTH:PH1)
STM32_PA4: JP2.10 U3.29(PORTA_L:PA4)
STM32_PA5: JP2.11 U3.30(PORTA_L:PA5)
STM32_PA8: U3.67(PORTA_H:PA8)
STM32_PB12: U3.51(PORTB_H:PB12) ; also sheet 10
STM32_PB13: U3.52(PORTB_H:PB13) ; also sheet 10
STM32_PB14: U3.53(PORTB_H:PB14) ; also sheet 10
STM32_PC4: IC4.6(!A!/B) IC5.6(!A!/B) U3.33(PORTC_L:PC4) U11.6(OE)
STM32_PC6: U3.63(PORTC_L:PC6)
STM32_PC7: U3.64(PORTC_L:PC7)
STM32_PC8: U3.65(PORTC_H:PC8)
STM32_PC9: JP2.20 U3.66(PORTC_H:PC9)
STM32_PC10: JP2.19 U3.78(PORTC_H:PC10)
STM32_PC11: JP2.18 U3.79(PORTC_H:PC11)
STM32_PC12: JP2.17 U3.80(PORTC_H:PC12)
STM32_PC13: BAT1.8(!RESET) U3.7(PORTC_H:PC13)
STM32_PC14: JP2.2 U3.8(PORTC_H:PC14)
STM32_PC15: JP2.1 U3.9(PORTC_H:PC15)
STM32_PD2: U3.83(PORTD_L:PD2)
STM32_PD4: U3.85(PORTD_L:PD4)
STM32_PD7: JP2.13 U3.88(PORTD_L:PD7)
STM32_PD10: U3.57(PORTD_H:PD10) ; also sheet 10
STM32_PD11: U3.58(PORTD_H:PD11) ; also sheet 10
STM32_PD12: U3.59(PORTD_H:PD12) ; also sheet 10
STM32_PD13: U3.60(PORTD_H:PD13) ; also sheet 10
STM32_PD14: U3.61(PORTD_H:PD14) ; also sheet 10
STM32_PD15: BAT1.5(EN) U3.62(PORTD_H:PD15)
STM32_PE0: JP2.9 U3.97(PORTE_L:PE0)
STM32_PE1: JP2.8 U3.98(PORTE_L:PE1)
STM32_PE2: JP2.7 U3.1(PORTE_L:PE2)
STM32_PE3: JP2.6 U3.2(PORTE_L:PE3)
STM32_PE4: JP2.5 U3.3(PORTE_L:PE4)
STM32_PE5: JP2.4 U3.4(PORTE_L:PE5)
STM32_PE6: JP2.3 U3.5(PORTE_L:PE6)
STM32_PE11: U3.42(PORTE_H:PE11) ; also sheet 7
STM32_PE12: U3.43(PORTE_H:PE12) ; also sheet 16
STM32_PH2: U3.73(PORTH:PH2)
STM32_SPI1_MISO: U3.45(PORTE_H:PE14) ; also sheet 16
STM32_SPI1_MOSI: U3.46(PORTE_H:PE15) ; also sheet 16
STM32_SPI1_SCK: U3.44(PORTE_H:PE13) ; also sheet 16
STM32_SPI2_MISO: U3.84(PORTD_L:PD3) ; also sheet 10
STM32_SPI2_MOSI: U3.54(PORTB_H:PB15) ; also sheet 10
STM32_SPI2_NSS: U3.81(PORTD_L:PD0) ; also sheet 10
STM32_SPI2_SCK: U3.82(PORTD_L:PD1) ; also sheet 10
STM32_TIM3_CH2: U3.91(PORTB_L:PB5) ; also sheet 2
STM32_TIM4_CH3: U3.95(PORTB_H:PB8)
STM32_U1_RX: U3.93(PORTB_L:PB7) ; also sheet 2
STM32_U1_TX: U3.92(PORTB_L:PB6) ; also sheet 2
STM32_U1RX: U3.68(PORTA_H:PA9)
STM32_U1TX: U3.69(PORTA_H:PA10)
STM32_U2_RX: JP2.15 U3.87(PORTD_L:PD6)
STM32_U2_TX: JP2.16 U3.86(PORTD_L:PD5)
STM32_U3RX: U3.56(PORTD_H:PD9) ; also sheet 10
STM32_U3TX: U3.55(PORTD_H:PD8) ; also sheet 10
T_JTCK: U3.76(PORTA_H:PA14) ; also sheet 5
T_JTDI: U3.77(PORTA_H:PA15) ; also sheet 5
T_JTDO: U3.89(PORTB_L:PB3) ; also sheet 5
T_JTMS: U3.72(PORTA_H:PA13) ; also sheet 5
T_JTRST: U3.90(PORTB_L:PB4) ; also sheet 5
T_NRST: U3.14(BOOT:NRST) ; also sheet 5,8
USB_DM: U3.70(PORTA_H:PA11) ; also sheet 8
USB_DP: U3.71(PORTA_H:PA12) ; also sheet 8
VBAT: BAT1.2(VOUT) C2.1 C38.1 C39.1 C40.1 C41.1 C42.1 C103.1 U3.11(DPWR:VDD_5) U3.21(APWR:VREF+) U3.22(APWR:VDDA) U3.28(DPWR:VDD_4) U3.50(DPWR:VDD_1) U3.75(DPWR:VDD_2) U3.100(DPWR:VDD_3)

### Notes on the sheet
- 21 | 22
- 23 | 24
- 25 | 26
- 27 | 28
- 29 | 30
- 31
- 32
- 33 | 34
- 35 | 36
- 37 | 38
- Powered ADC inputs
- STM32 Coprocessor

## Sheet 5 of 16
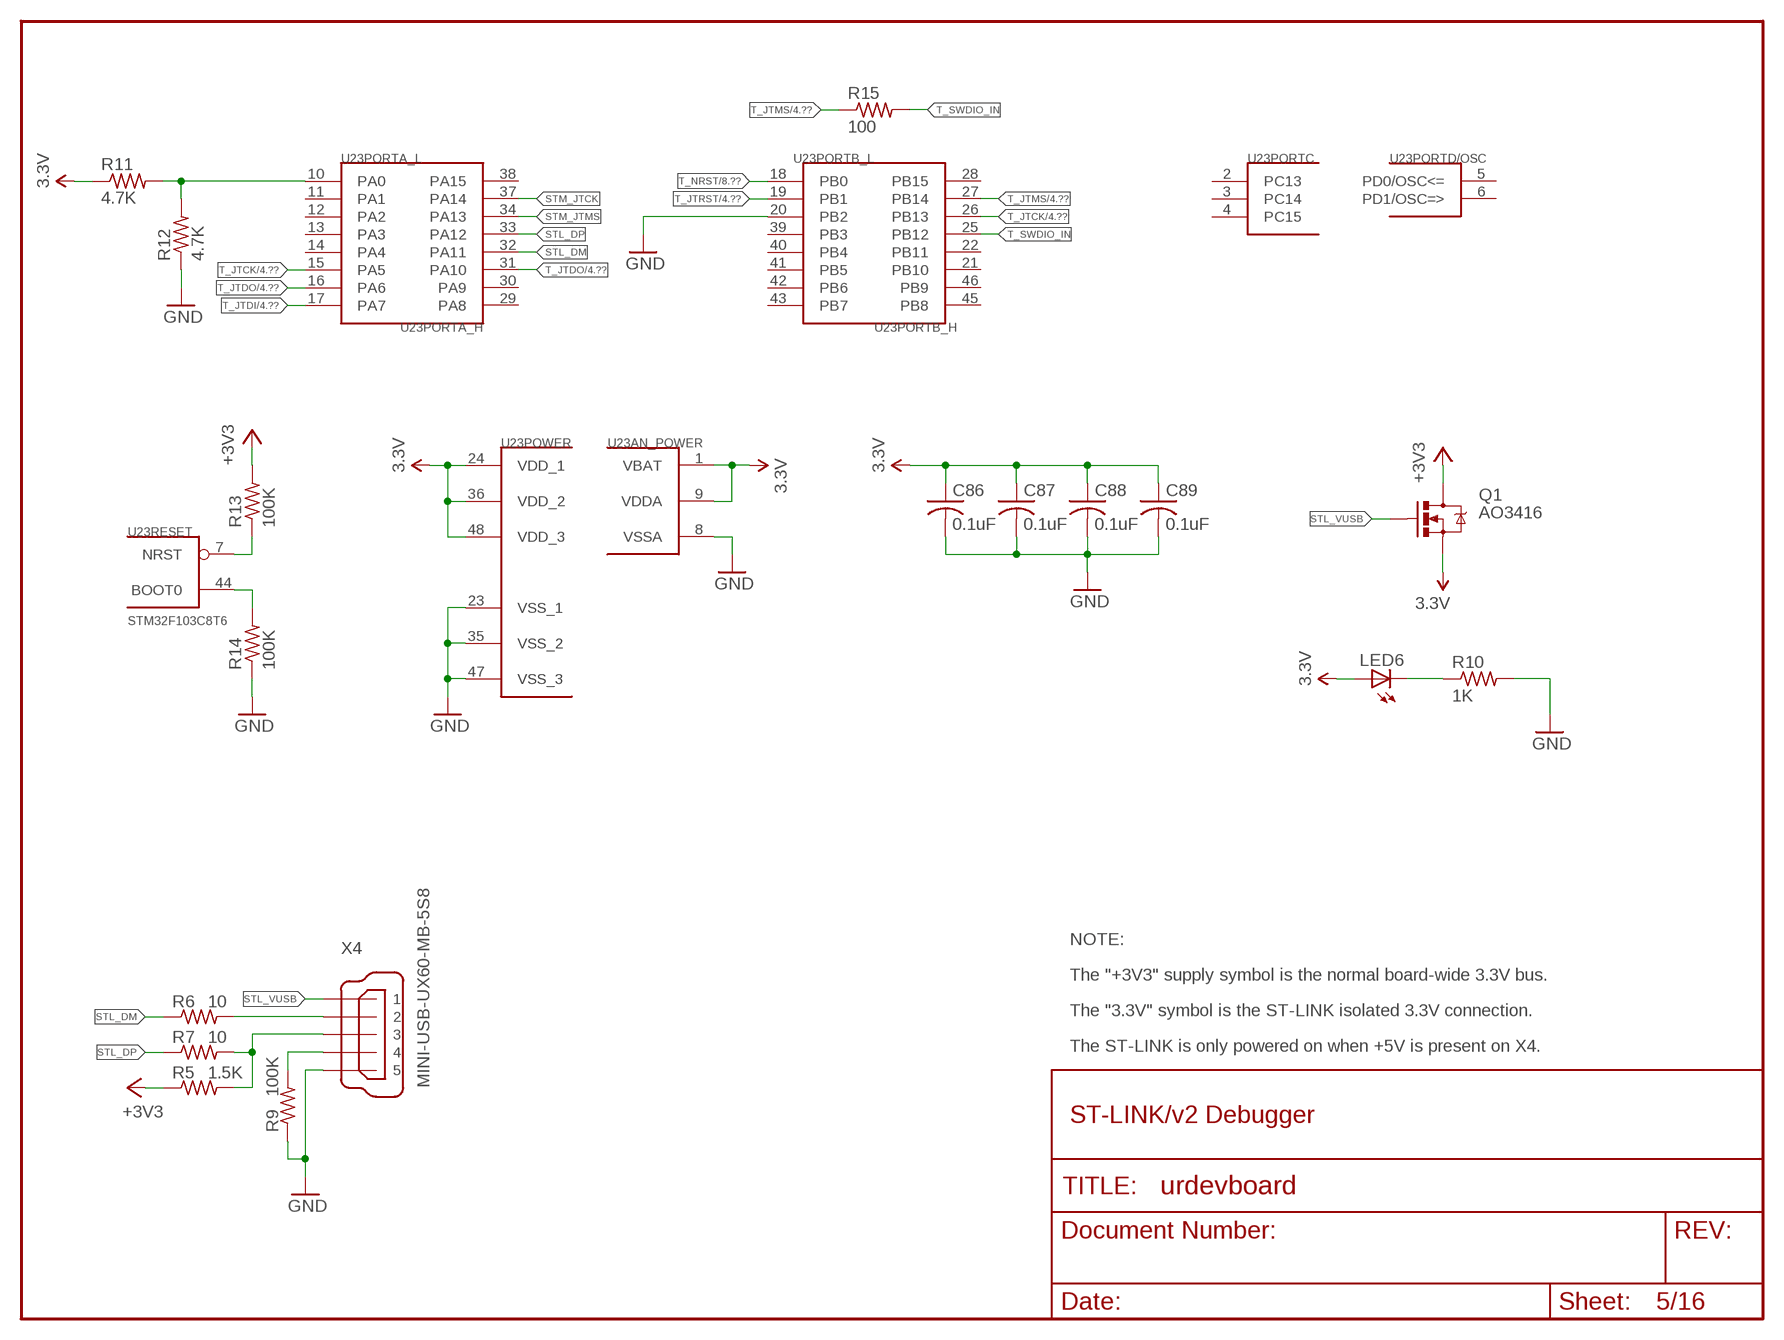
[diagram p4: schematic, sheet 5]

### Parts
C86  0.1uF  C-USC0603  [C0603]
C87  0.1uF  C-USC0603  [C0603]
C88  0.1uF  C-USC0603  [C0603]
C89  0.1uF  C-USC0603  [C0603]
LED6  LEDCHIPLED_0603  [CHIPLED_0603]
Q1  AO3416  MOSFET-NCHANNELSMD  [SOT23-3]
R5  1.5K  R-US_R0402  [R0402]
R6  10  R-US_R0402  [R0402]
R7  10  R-US_R0402  [R0402]
R9  100K  R-US_R0402  [R0402]
R10  1K  R-US_R0603  [R0603]
R11  4.7K  R-US_R0402  [R0402]
R12  4.7K  R-US_R0402  [R0402]
R13  100K  R-US_R0402  [R0402]
R14  100K  R-US_R0402  [R0402]
R15  100  R-US_R0402  [R0402]
U23  STM32F103C8T6  STM32F10XCXT6  [TQFP48]
X4  MINI-USB-UX60-MB-5S8  [UX60-MB-5S8]

### Nets
3.3V: C86.1 C87.1 C88.1 C89.1 LED6.A Q1.2(S) R11.1 U23.1(AN_POWER:VBAT) U23.9(AN_POWER:VDDA) U23.24(POWER:VDD_1) U23.36(POWER:VDD_2) U23.48(POWER:VDD_3)
+3V3: Q1.3(D) R5.1 R13.2 ; also sheet 1,2,3,4,6,7,8,9,10,11,16
GND: C86.2 C87.2 C88.2 C89.2 R9.1 R10.2 R12.1 R14.1 U23.8(AN_POWER:VSSA) U23.20(PORTB_L:PB2) U23.23(POWER:VSS_1) U23.35(POWER:VSS_2) U23.47(POWER:VSS_3) X4.5 ; also sheet 1,2,3,4,6,7,8,9,10,11,12,13,14,15,16
LED6: LED6.C R10.1
STL_AIN1: R11.2 R12.2 U23.10(PORTA_L:PA0)
STL_BOOT0: R14.2 U23.44(RESET:BOOT0)
STL_DM: R6.1 U23.32(PORTA_H:PA11)
STL_DP: R7.1 U23.33(PORTA_H:PA12)
STL_NRST: R13.1 U23.7(RESET:NRST)
STL_VUSB: Q1.1(G) X4.1
STM_JTCK: U23.37(PORTA_H:PA14)
STM_JTMS: U23.34(PORTA_H:PA13)
T_JTCK: U23.15(PORTA_L:PA5) U23.26(PORTB_H:PB13) ; also sheet 4
T_JTDI: U23.17(PORTA_L:PA7) ; also sheet 4
T_JTDO: U23.16(PORTA_L:PA6) U23.31(PORTA_H:PA10) ; also sheet 4
T_JTMS: R15.1 U23.27(PORTB_H:PB14) ; also sheet 4
T_JTRST: U23.19(PORTB_L:PB1) ; also sheet 4
T_NRST: U23.18(PORTB_L:PB0) ; also sheet 4,8
T_SWDIO_IN: R15.2 U23.25(PORTB_H:PB12)
X4_DM: R6.2 X4.2
X4_DP: R5.2 R7.2 X4.3
X4_ID: R9.2 X4.4
Unconnected: U23.2(PORTC:PC13) U23.3(PORTC:PC14) U23.4(PORTC:PC15) U23.5(PORTD/OSC:PD0/OSC<=) U23.6(PORTD/OSC:PD1/OSC=>) U23.11(PORTA_L:PA1) U23.12(PORTA_L:PA2) U23.13(PORTA_L:PA3) U23.14(PORTA_L:PA4) U23.21(PORTB_H:PB10) U23.22(PORTB_H:PB11) U23.28(PORTB_H:PB15) U23.29(PORTA_H:PA8) U23.30(PORTA_H:PA9) U23.38(PORTA_H:PA15) U23.39(PORTB_L:PB3) U23.40(PORTB_L:PB4) U23.41(PORTB_L:PB5) U23.42(PORTB_L:PB6) U23.43(PORTB_L:PB7) U23.45(PORTB_H:PB8) U23.46(PORTB_H:PB9)

### Notes on the sheet
- NOTE:
- The "+3V3" supply symbol is the normal board-wide 3.3V bus.
- The "3.3V" symbol is the ST-LINK isolated 3.3V connection.
- The ST-LINK is only powered on when +5V is present on X4.
- ST-LINK/v2 Debugger

## Sheet 6 of 16
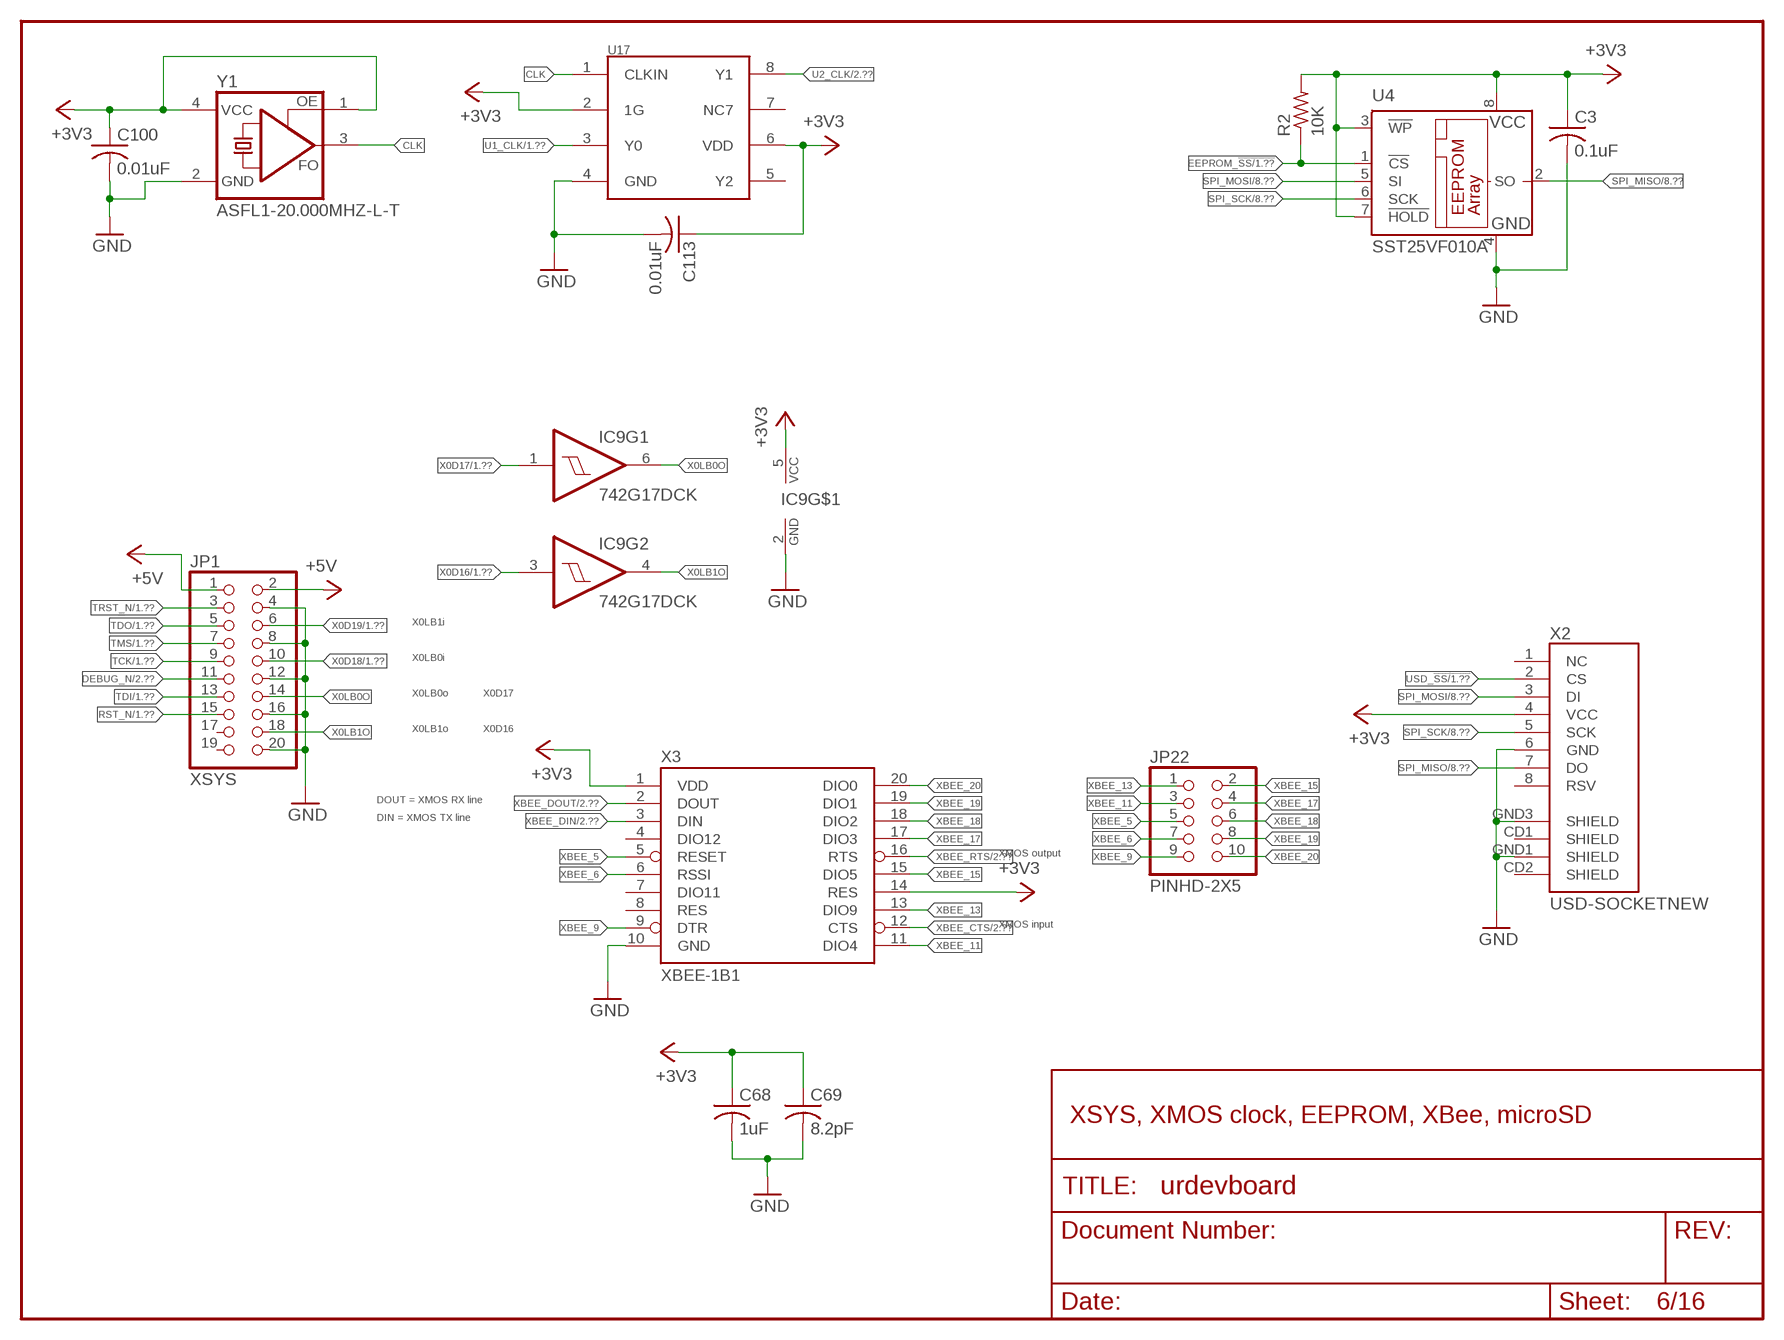
[diagram p5: schematic, sheet 6]

### Parts
C3  0.1uF  C-USC0603  [C0603]
C68  1uF  C-USC0603  [C0603]
C69  8.2pF  C-USC0603  [C0603]
C100  0.01uF  C-USC0603  [C0603]
C113  0.01uF  C-USC0402  [C0402]
IC9  742G17DCK  [DCK_R-PDSO-G6]
JP1  XSYS  PINHD-2X10  [2X10]
JP22  PINHD-2X5  [2X05]
R2  10K  R-US_R0603  [R0603]
U4  SST25VF010A  25LC080SN  [SO-08]
U17  CDCLVC1103  [PW_R-PDSO-G08]
X2  USD-SOCKETNEW  [MICRO-SD-SOCKET-PP]
X3  XBEE-1B1  [XBEE-1]
Y1  ASFL1-20.000MHZ-L-T  ASFL1  [ASF]

### Nets
+3V3: C3.1 C68.1 C69.1 C100.1 C113.1 IC9.5(VCC) R2.2 U4.3(!WP) U4.7(!HOLD) U4.8(VCC) U17.2(1G) U17.6(VDD) X2.4(VCC) X3.1(VDD) X3.14(RES) Y1.1(OE) Y1.4(VCC) ; also sheet 1,2,3,4,5,7,8,9,10,11,16
+5V: JP1.1 JP1.2 ; also sheet 3,4,7,8,10,12,13,14,15
CLK: U17.1(CLKIN) Y1.3(FO)
DEBUG_N: JP1.11 ; also sheet 1,2,3
EEPROM_!SS: R2.1 U4.1(!CS) ; also sheet 1
GND: C3.2 C68.2 C69.2 C100.2 C113.2 IC9.2(GND) JP1.4 JP1.8 JP1.12 JP1.16 JP1.20 U4.4(GND) U17.4(GND) X2.6(GND) X2.GND1(SHIELD) X2.GND3(SHIELD) X3.10(GND) Y1.2(GND) ; also sheet 1,2,3,4,5,7,8,9,10,11,12,13,14,15,16
RST_N: JP1.15 ; also sheet 1,2,3
SPI_MISO: U4.2(SO) X2.7(DO) ; also sheet 1,8
SPI_MOSI: U4.5(SI) X2.3(DI) ; also sheet 1,8
SPI_SCK: U4.6(SCK) X2.5(SCK) ; also sheet 1,8
TCK: JP1.9 ; also sheet 1,2,3
TDI: JP1.13 ; also sheet 1,2,3
TDO: JP1.5 ; also sheet 1,2,3
TMS: JP1.7 ; also sheet 1,2,3
TRST_N: JP1.3 ; also sheet 1,2,3
U1_CLK: U17.3(Y0) ; also sheet 1
U2_CLK: U17.8(Y1) ; also sheet 2
USD_!SS: X2.2(CS) ; also sheet 1
X0D16: IC9.3(I) ; also sheet 1
X0D17: IC9.1(I) ; also sheet 1
X0D18: JP1.10 ; also sheet 1
X0D19: JP1.6 ; also sheet 1
X0LB0O: IC9.6(O) JP1.14
X0LB1O: IC9.4(O) JP1.18
XBEE_5: JP22.5 X3.5(RESET)
XBEE_6: JP22.7 X3.6(RSSI)
XBEE_9: JP22.9 X3.9(DTR)
XBEE_11: JP22.3 X3.11(DIO4)
XBEE_13: JP22.1 X3.13(DIO9)
XBEE_15: JP22.2 X3.15(DIO5)
XBEE_17: JP22.4 X3.17(DIO3)
XBEE_18: JP22.6 X3.18(DIO2)
XBEE_19: JP22.8 X3.19(DIO1)
XBEE_20: JP22.10 X3.20(DIO0)
XBEE_CTS: X3.12(CTS) ; also sheet 2
XBEE_DIN: X3.3(DIN) ; also sheet 2
XBEE_DOUT: X3.2(DOUT) ; also sheet 2
XBEE_RTS: X3.16(RTS) ; also sheet 2
Unconnected: JP1.17 JP1.19 U17.5(Y2) U17.7(NC7) X2.1(NC) X2.8(RSV) X2.CD1(SHIELD) X2.CD2(SHIELD) X3.4(DIO12) X3.7(DIO11) X3.8(RES)

### Notes on the sheet
- X0LB1i
- X0LB0i
- X0LB0o | X0D17
- X0LB1o | X0D16
- DOUT = XMOS RX line
- DIN = XMOS TX line
- XMOS output
- XMOS input
- XSYS, XMOS clock, EEPROM, XBee, microSD

## Sheet 7 of 16
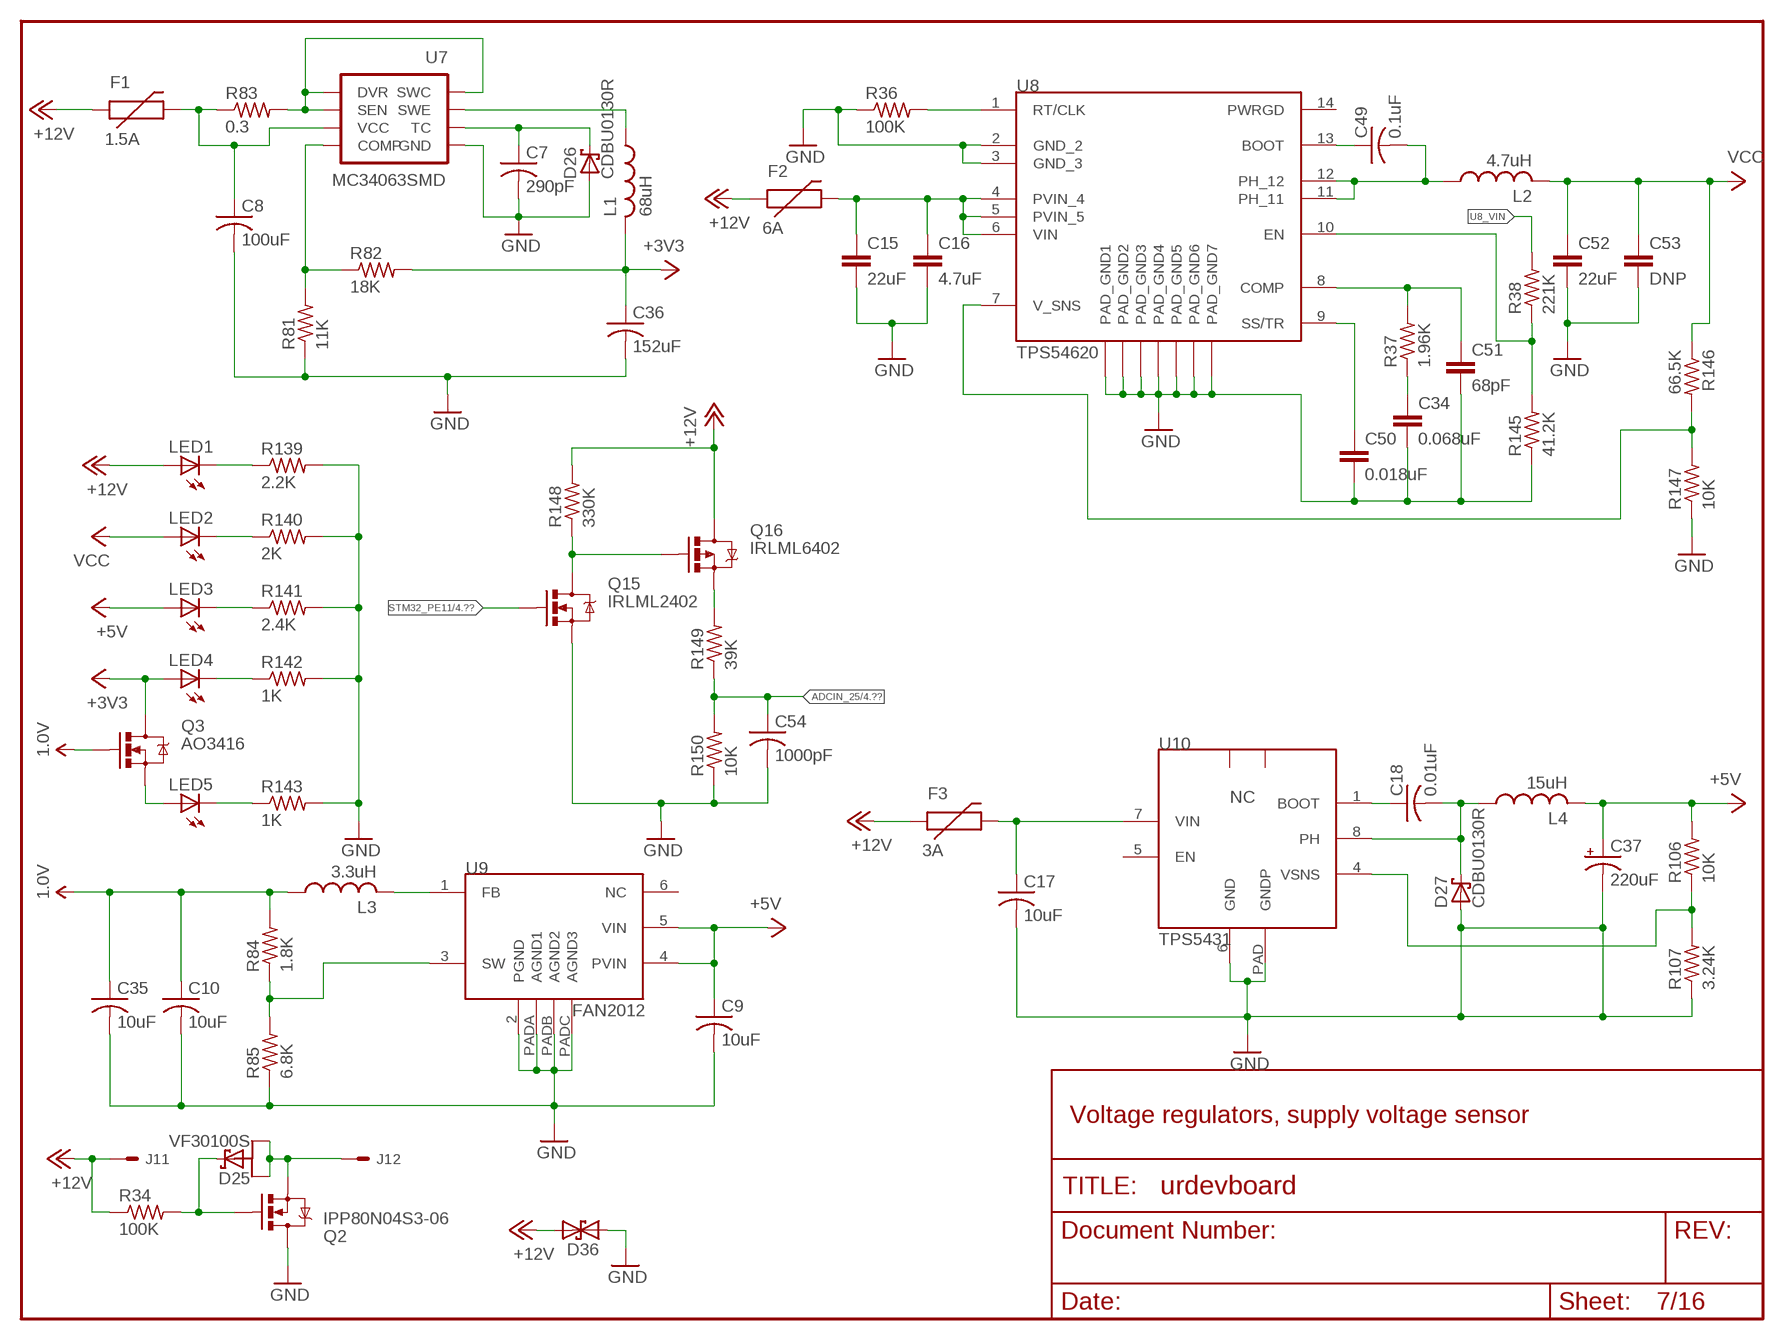
[diagram p6: schematic, sheet 7]

### Parts
C7  290pF  C-USC0603  [C0603]
C8  100uF  C-USC0805  [C0805]
C9  10uF  C-USC0805  [C0805]
C10  10uF  C-USC0805  [C0805]
C15  22uF  CAP_  [AXIAL-5MM]
C16  4.7uF  CAP_  [AXIAL-5MM]
C17  10uF  C-USC0805  [C0805]
C18  0.01uF  C-USC0603  [C0603]
C34  0.068uF  CAP_  [AXIAL-5MM]
C35  10uF  C-USC0805  [C0805]
C36  152uF  C-USC0805  [C0805]
C37  220uF  CPOL-USD  [PANASONIC_D]
C49  0.1uF  C-USC0603  [C0603]
C50  0.018uF  CAP_  [AXIAL-5MM]
C51  68pF  CAP_  [AXIAL-5MM]
C52  22uF  CAP_  [AXIAL-5MM]
C53  DNP  CAP_  [AXIAL-5MM]
C54  1000pF  C-USC0603  [C0603]
D25  VF30100S  SCHOTTKY-3  [TO220ABS]
D26  CDBU0130R  SCHOTTKY-DIODESO523  [SOD523]
D27  CDBU0130R  SCHOTTKY-DIODESO523  [SOD523]
D36  DIODE_SCHOTTKY2-DO201  [DO201T15]
F1  1.5A  PTCPTH  [PTC]
F2  6A  PTCPTH  [PTC]
F3  3A  PTCPTH  [PTC]
J1  ESPM02200  [ESPM02200]
L1  68uH  L-USSLF12565  [SLF12565]
L2  4.7uH  L-US0207/5V  [0207/5V]
L3  3.3uH  L-USPANASONIC_ELL6  [PANASONIC_ELL6]
L4  15uH  L-USIHLP-3232DZ  [IHLP-3232DZ]
LED1  LEDCHIPLED_0603  [CHIPLED_0603]
LED2  LEDCHIPLED_0603  [CHIPLED_0603]
LED3  LEDCHIPLED_0603  [CHIPLED_0603]
LED4  LEDCHIPLED_0603  [CHIPLED_0603]
LED5  LEDCHIPLED_0603  [CHIPLED_0603]
Q2  IPP80N04S3-06  MOSFET-NCHANNELPTH2  [TO220V]
Q3  AO3416  MOSFET-NCHANNELSMD  [SOT23-3]
Q15  IRLML2402  MOSFET-NCHANNELSMD  [SOT23-3]
Q16  IRLML6402  MOSFET-PCHANNELSMD  [SOT23-3]
R34  100K  R-US_R0603  [R0603]
R36  100K  R-US_R0603  [R0603]
R37  1.96K  R-US_0207/5V  [0207/5V]
R38  221K  R-US_0207/5V  [0207/5V]
R81  11K  R-US_R0603  [R0603]
R82  18K  R-US_R0603  [R0603]
R83  0.3  R-US_R0402  [R0402]
R84  1.8K  R-US_R0603  [R0603]
R85  6.8K  R-US_R0603  [R0603]
R106  10K  R-US_R0603  [R0603]
R107  3.24K  R-US_R0603  [R0603]
R139  2.2K  R-US_R0603  [R0603]
R140  2K  R-US_R0603  [R0603]
R141  2.4K  R-US_R0603  [R0603]
R142  1K  R-US_R0603  [R0603]
R143  1K  R-US_R0603  [R0603]
R145  41.2K  R-US_0207/5V  [0207/5V]
R146  66.5K  R-US_0207/5V  [0207/5V]
R147  10K  R-US_R0603  [R0603]
R148  330K  R-US_R0603  [R0603]
R149  39K  R-US_R0603  [R0603]
R150  10K  R-US_R0603  [R0603]
U7  MC34063SMD  [SO08]
U8  TPS54620  [S-PVQFN-N14]
U9  FAN2012  [MLP6]
U10  TPS5431  [R-PDSO-G08]

### Nets
1.0V: C10.1 C35.1 L3.1 Q3.1(G) R84.2 ; also sheet 1,2
+3V3: C36.1 L1.2 LED4.A Q3.3(D) R82.2 ; also sheet 1,2,3,4,5,6,8,9,10,11,16
+5V: C9.1 C37.+ L4.2 LED3.A R106.2 U9.4(PVIN) U9.5(VIN) ; also sheet 3,4,6,8,10,12,13,14,15
+12V: D36.C F1.P$1 F2.P$1 F3.P$1 J1.1 LED1.A Q16.3(D) R34.1 R148.2 ; also sheet 8,13,14,15,16
ADCIN_25: C54.1 R149.1 R150.2 ; also sheet 4
G2_G: D25.C Q2.1(G) R34.2
GND: C7.2 C8.2 C9.2 C10.2 C15.P$2 C16.P$2 C17.2 C34.P$2 C35.2 C36.2 C37.- C50.P$2 C51.P$2 C52.P$2 C53.P$2 C54.2 D26.A D27.A D36.A Q2.2(D) Q15.2(S) R36.1 R81.1 R85.1 R107.1 R139.2 R140.2 R141.2 R142.2 R143.2 R145.1 R147.1 R150.1 U7.4(GND) U8.2(GND_2) U8.3(GND_3) U8.PAD1(PAD_GND1) U8.PAD2(PAD_GND2) U8.PAD3(PAD_GND3) U8.PAD4(PAD_GND4) U8.PAD5(PAD_GND5) U8.PAD6(PAD_GND6) U8.PAD7(PAD_GND7) U9.2(PGND) U9.PADA(AGND1) U9.PADB(AGND2) U9.PADC(AGND3) U10.6(GND) U10.PAD(GNDP) ; also sheet 1,2,3,4,5,6,8,9,10,11,12,13,14,15,16
J1_GND: D25.A1 D25.A2 J1.2 Q2.3(S)
LED1: LED1.C R139.1
LED2: LED2.C R140.1
LED3: LED3.C R141.1
LED4: LED4.C R142.1
LED5: LED5.C R143.1
Q3_S: LED5.A Q3.2(S)
Q32_R149: Q16.2(S) R149.2
R37_C34: C34.P$1 R37.1
SCM_FETS: Q15.3(D) Q16.1(G) R148.1
STM32_PE11: Q15.1(G) ; also sheet 4
U7_COMP: R81.2 R82.1 U7.5(COMP)
U7_SWC: R83.2 U7.1(SWC) U7.7(SEN) U7.8(DVR)
U7_SWE: L1.1 U7.2(SWE)
U7_TC: C7.1 D26.C U7.3(TC)
U7_VCC: C8.1 F1.P$2 R83.1 U7.6(VCC)
U8_BOOT: C49.1 U8.13(BOOT)
U8_COMP: C51.P$1 R37.2 U8.8(COMP)
U8_EN: R38.1 R145.2 U8.10(EN)
U8_PH: C49.2 L2.1 U8.11(PH_11) U8.12(PH_12)
U8_RT: R36.2 U8.1(RT/CLK)
U8_SS/TR: C50.P$1 U8.9(SS/TR)
U8_VIN: C15.P$1 C16.P$1 F2.P$2 R38.2 U8.4(PVIN_4) U8.5(PVIN_5) U8.6(VIN)
U8_VSNS: R146.2 R147.2 U8.7(V_SNS)
U9_FB: L3.2 U9.1(FB)
U9_SW: R84.1 R85.2 U9.3(SW)
U10_BOOT: C18.1 U10.1(BOOT)
U10_PH: C18.2 D27.C L4.1 U10.8(PH)
U10_VIN: C17.1 F3.P$2 U10.7(VIN)
U10_VSNS: R106.1 R107.2 U10.4(VSNS)
VCC: C52.P$1 C53.P$1 L2.2 LED2.A R146.1 ; also sheet 12
Unconnected: U8.14(PWRGD) U9.6(NC) U10.2(NC1) U10.3(NC2) U10.5(EN)

### Notes on the sheet
- Voltage regulators, supply voltage sensor

## Sheet 8 of 16
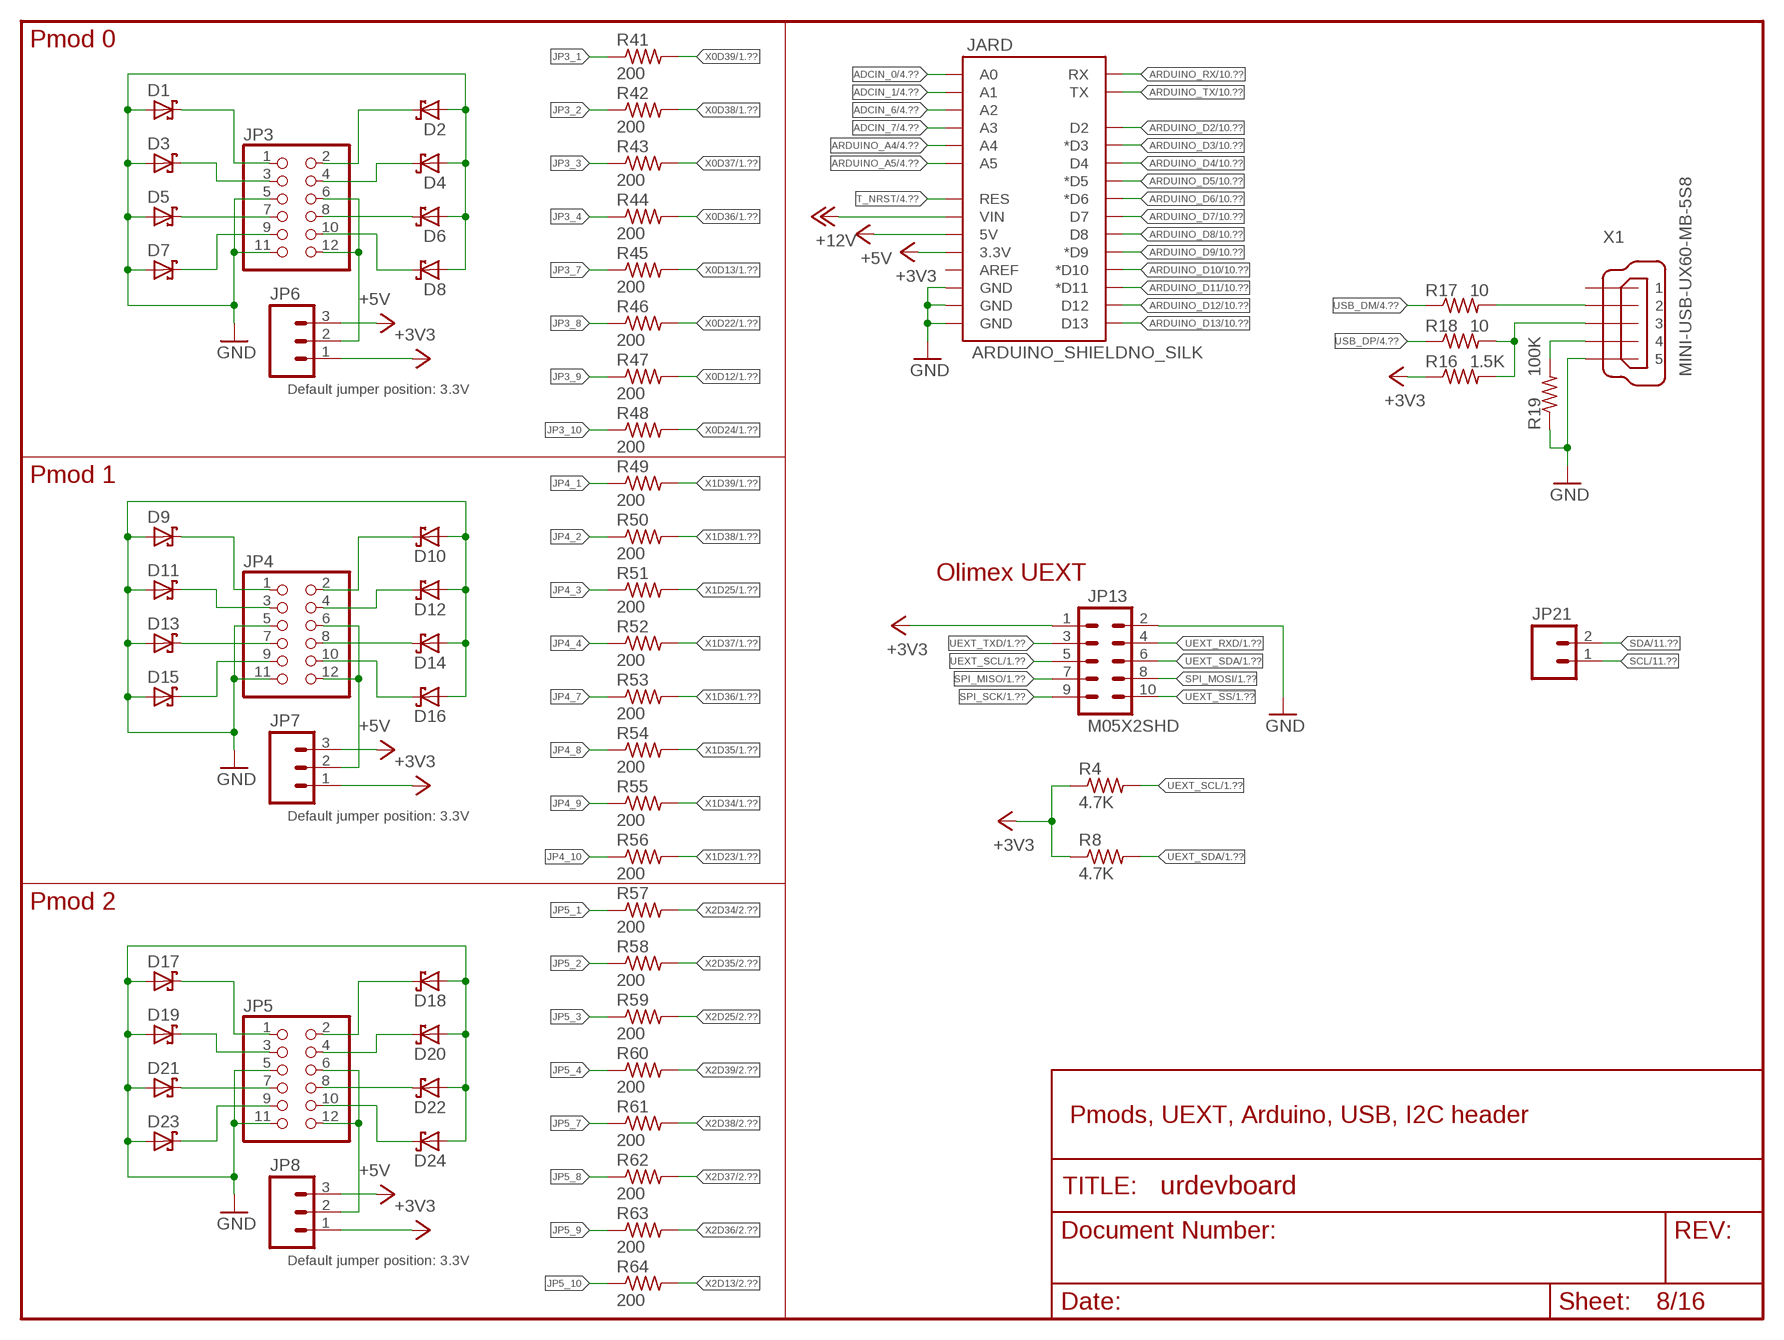
[diagram p7: schematic, sheet 8]

### Parts
D1  SCHOTTKY-DIODESO523  [SOD523]
D2  SCHOTTKY-DIODESO523  [SOD523]
D3  SCHOTTKY-DIODESO523  [SOD523]
D4  SCHOTTKY-DIODESO523  [SOD523]
D5  SCHOTTKY-DIODESO523  [SOD523]
D6  SCHOTTKY-DIODESO523  [SOD523]
D7  SCHOTTKY-DIODESO523  [SOD523]
D8  SCHOTTKY-DIODESO523  [SOD523]
D9  SCHOTTKY-DIODESO523  [SOD523]
D10  SCHOTTKY-DIODESO523  [SOD523]
D11  SCHOTTKY-DIODESO523  [SOD523]
D12  SCHOTTKY-DIODESO523  [SOD523]
D13  SCHOTTKY-DIODESO523  [SOD523]
D14  SCHOTTKY-DIODESO523  [SOD523]
D15  SCHOTTKY-DIODESO523  [SOD523]
D16  SCHOTTKY-DIODESO523  [SOD523]
D17  SCHOTTKY-DIODESO523  [SOD523]
D18  SCHOTTKY-DIODESO523  [SOD523]
D19  SCHOTTKY-DIODESO523  [SOD523]
D20  SCHOTTKY-DIODESO523  [SOD523]
D21  SCHOTTKY-DIODESO523  [SOD523]
D22  SCHOTTKY-DIODESO523  [SOD523]
D23  SCHOTTKY-DIODESO523  [SOD523]
D24  SCHOTTKY-DIODESO523  [SOD523]
JARD  ARDUINO_SHIELDNO_SILK  [DUEMILANOVE_VIAS]
JP3  PINHD-2X6  [2X06]
JP4  PINHD-2X6  [2X06]
JP5  PINHD-2X6  [2X06]
JP6  M03PTH  [1X03]
JP7  M03PTH  [1X03]
JP8  M03PTH  [1X03]
JP13  M05X2SHD  [2X5-SHROUDED]
JP21  M02PTH  [1X02]
R4  4.7K  R-US_R0603  [R0603]
R8  4.7K  R-US_R0603  [R0603]
R16  1.5K  R-US_R0402  [R0402]
R17  10  R-US_R0402  [R0402]
R18  10  R-US_R0402  [R0402]
R19  100K  R-US_R0402  [R0402]
R41  200  R-US_R0402  [R0402]
R42  200  R-US_R0402  [R0402]
R43  200  R-US_R0402  [R0402]
R44  200  R-US_R0402  [R0402]
R45  200  R-US_R0402  [R0402]
R46  200  R-US_R0402  [R0402]
R47  200  R-US_R0402  [R0402]
R48  200  R-US_R0402  [R0402]
R49  200  R-US_R0402  [R0402]
R50  200  R-US_R0402  [R0402]
R51  200  R-US_R0402  [R0402]
R52  200  R-US_R0402  [R0402]
R53  200  R-US_R0402  [R0402]
R54  200  R-US_R0402  [R0402]
R55  200  R-US_R0402  [R0402]
R56  200  R-US_R0402  [R0402]
R57  200  R-US_R0402  [R0402]
R58  200  R-US_R0402  [R0402]
R59  200  R-US_R0402  [R0402]
R60  200  R-US_R0402  [R0402]
R61  200  R-US_R0402  [R0402]
R62  200  R-US_R0402  [R0402]
R63  200  R-US_R0402  [R0402]
R64  200  R-US_R0402  [R0402]
X1  MINI-USB-UX60-MB-5S8  [UX60-MB-5S8]

### Nets
+3V3: JARD.3.3V JP6.1 JP7.1 JP8.1 JP13.1 R4.1 R8.1 R16.1 ; also sheet 1,2,3,4,5,6,7,9,10,11,16
+5V: JARD.5V JP6.3 JP7.3 JP8.3 ; also sheet 3,4,6,7,10,12,13,14,15
+12V: JARD.VIN ; also sheet 7,13,14,15,16
ADCIN_0: JARD.A0 ; also sheet 4
ADCIN_1: JARD.A1 ; also sheet 4
ADCIN_6: JARD.A2 ; also sheet 4
ADCIN_7: JARD.A3 ; also sheet 4
ARDUINO_A4: JARD.A4 ; also sheet 4
ARDUINO_A5: JARD.A5 ; also sheet 4
ARDUINO_D2: JARD.D2 ; also sheet 10
ARDUINO_D3: JARD.D3(*D3) ; also sheet 10
ARDUINO_D4: JARD.D4 ; also sheet 10
ARDUINO_D5: JARD.D5(*D5) ; also sheet 10
ARDUINO_D6: JARD.D6(*D6) ; also sheet 10
ARDUINO_D7: JARD.D7 ; also sheet 10
ARDUINO_D8: JARD.D8 ; also sheet 10
ARDUINO_D9: JARD.D9(*D9) ; also sheet 10
ARDUINO_D10: JARD.D10(*D10) ; also sheet 10
ARDUINO_D11: JARD.D11(*D11) ; also sheet 10
ARDUINO_D12: JARD.D12 ; also sheet 10
ARDUINO_D13: JARD.D13 ; also sheet 10
ARDUINO_RX: JARD.RX ; also sheet 10
ARDUINO_TX: JARD.TX ; also sheet 10
GND: D1.A D2.A D3.A D4.A D5.A D6.A D7.A D8.A D9.A D10.A D11.A D12.A D13.A D14.A D15.A D16.A D17.A D18.A D19.A D20.A D21.A D22.A D23.A D24.A JARD.GND@0(GND) JARD.GND@1(GND) JARD.GND@2(GND) JP3.5 JP3.11 JP4.5 JP4.11 JP5.5 JP5.11 JP13.2 R19.1 X1.5 ; also sheet 1,2,3,4,5,6,7,9,10,11,12,13,14,15,16
JP3_1: D1.C JP3.1 R41.1
JP3_2: D2.C JP3.2 R42.1
JP3_3: D3.C JP3.3 R43.1
JP3_4: D4.C JP3.4 R44.1
JP3_7: D5.C JP3.7 R45.1
JP3_8: D6.C JP3.8 R46.1
JP3_9: D7.C JP3.9 R47.1
JP3_10: D8.C JP3.10 R48.1
JP3_VCC: JP3.6 JP3.12 JP6.2
JP4_1: D9.C JP4.1 R49.1
JP4_2: D10.C JP4.2 R50.1
JP4_3: D11.C JP4.3 R51.1
JP4_4: D12.C JP4.4 R52.1
JP4_7: D13.C JP4.7 R53.1
JP4_8: D14.C JP4.8 R54.1
JP4_9: D15.C JP4.9 R55.1
JP4_10: D16.C JP4.10 R56.1
JP4_VCC: JP4.6 JP4.12 JP7.2
JP5_1: D17.C JP5.1 R57.1
JP5_2: D18.C JP5.2 R58.1
JP5_3: D19.C JP5.3 R59.1
JP5_4: D20.C JP5.4 R60.1
JP5_7: D21.C JP5.7 R61.1
JP5_8: D22.C JP5.8 R62.1
JP5_9: D23.C JP5.9 R63.1
JP5_10: D24.C JP5.10 R64.1
JP5_VCC: JP5.6 JP5.12 JP8.2
SCL: JP21.1 ; also sheet 1,2,11
SDA: JP21.2 ; also sheet 1,2,11
SPI_MISO: JP13.7 ; also sheet 1,6
SPI_MOSI: JP13.8 ; also sheet 1,6
SPI_SCK: JP13.9 ; also sheet 1,6
T_NRST: JARD.RES ; also sheet 4,5
UEXT_!SS: JP13.10 ; also sheet 1
UEXT_RXD: JP13.4 ; also sheet 1
UEXT_SCL: JP13.5 R4.2 ; also sheet 1
UEXT_SDA: JP13.6 R8.2 ; also sheet 1
UEXT_TXD: JP13.3 ; also sheet 1
USB_DM: R17.1 ; also sheet 4
USB_DP: R18.1 ; also sheet 4
X0D12: R47.2 ; also sheet 1
X0D13: R45.2 ; also sheet 1
X0D22: R46.2 ; also sheet 1
X0D24: R48.2 ; also sheet 1
X0D36: R44.2 ; also sheet 1
X0D37: R43.2 ; also sheet 1
X0D38: R42.2 ; also sheet 1
X0D39: R41.2 ; also sheet 1
X1_DM: R17.2 X1.2
X1_DP: R16.2 R18.2 X1.3
X1_ID: R19.2 X1.4
X1D23: R56.2 ; also sheet 1
X1D25: R51.2 ; also sheet 1
X1D34: R55.2 ; also sheet 1
X1D35: R54.2 ; also sheet 1
X1D36: R53.2 ; also sheet 1
X1D37: R52.2 ; also sheet 1
X1D38: R50.2 ; also sheet 1
X1D39: R49.2 ; also sheet 1
X2D13: R64.2 ; also sheet 2
X2D25: R59.2 ; also sheet 2
X2D34: R57.2 ; also sheet 2
X2D35: R58.2 ; also sheet 2
X2D36: R63.2 ; also sheet 2
X2D37: R62.2 ; also sheet 2
X2D38: R61.2 ; also sheet 2
X2D39: R60.2 ; also sheet 2
Unconnected: JARD.AREF X1.1

### Notes on the sheet
- Pmod 0
- Default jumper position: 3.3V
- Pmod 1
- Olimex UEXT
- Default jumper position: 3.3V
- Pmod 2
- Pmods, UEXT, Arduino, USB, I2C header
- Default jumper position: 3.3V

## Sheet 9 of 16
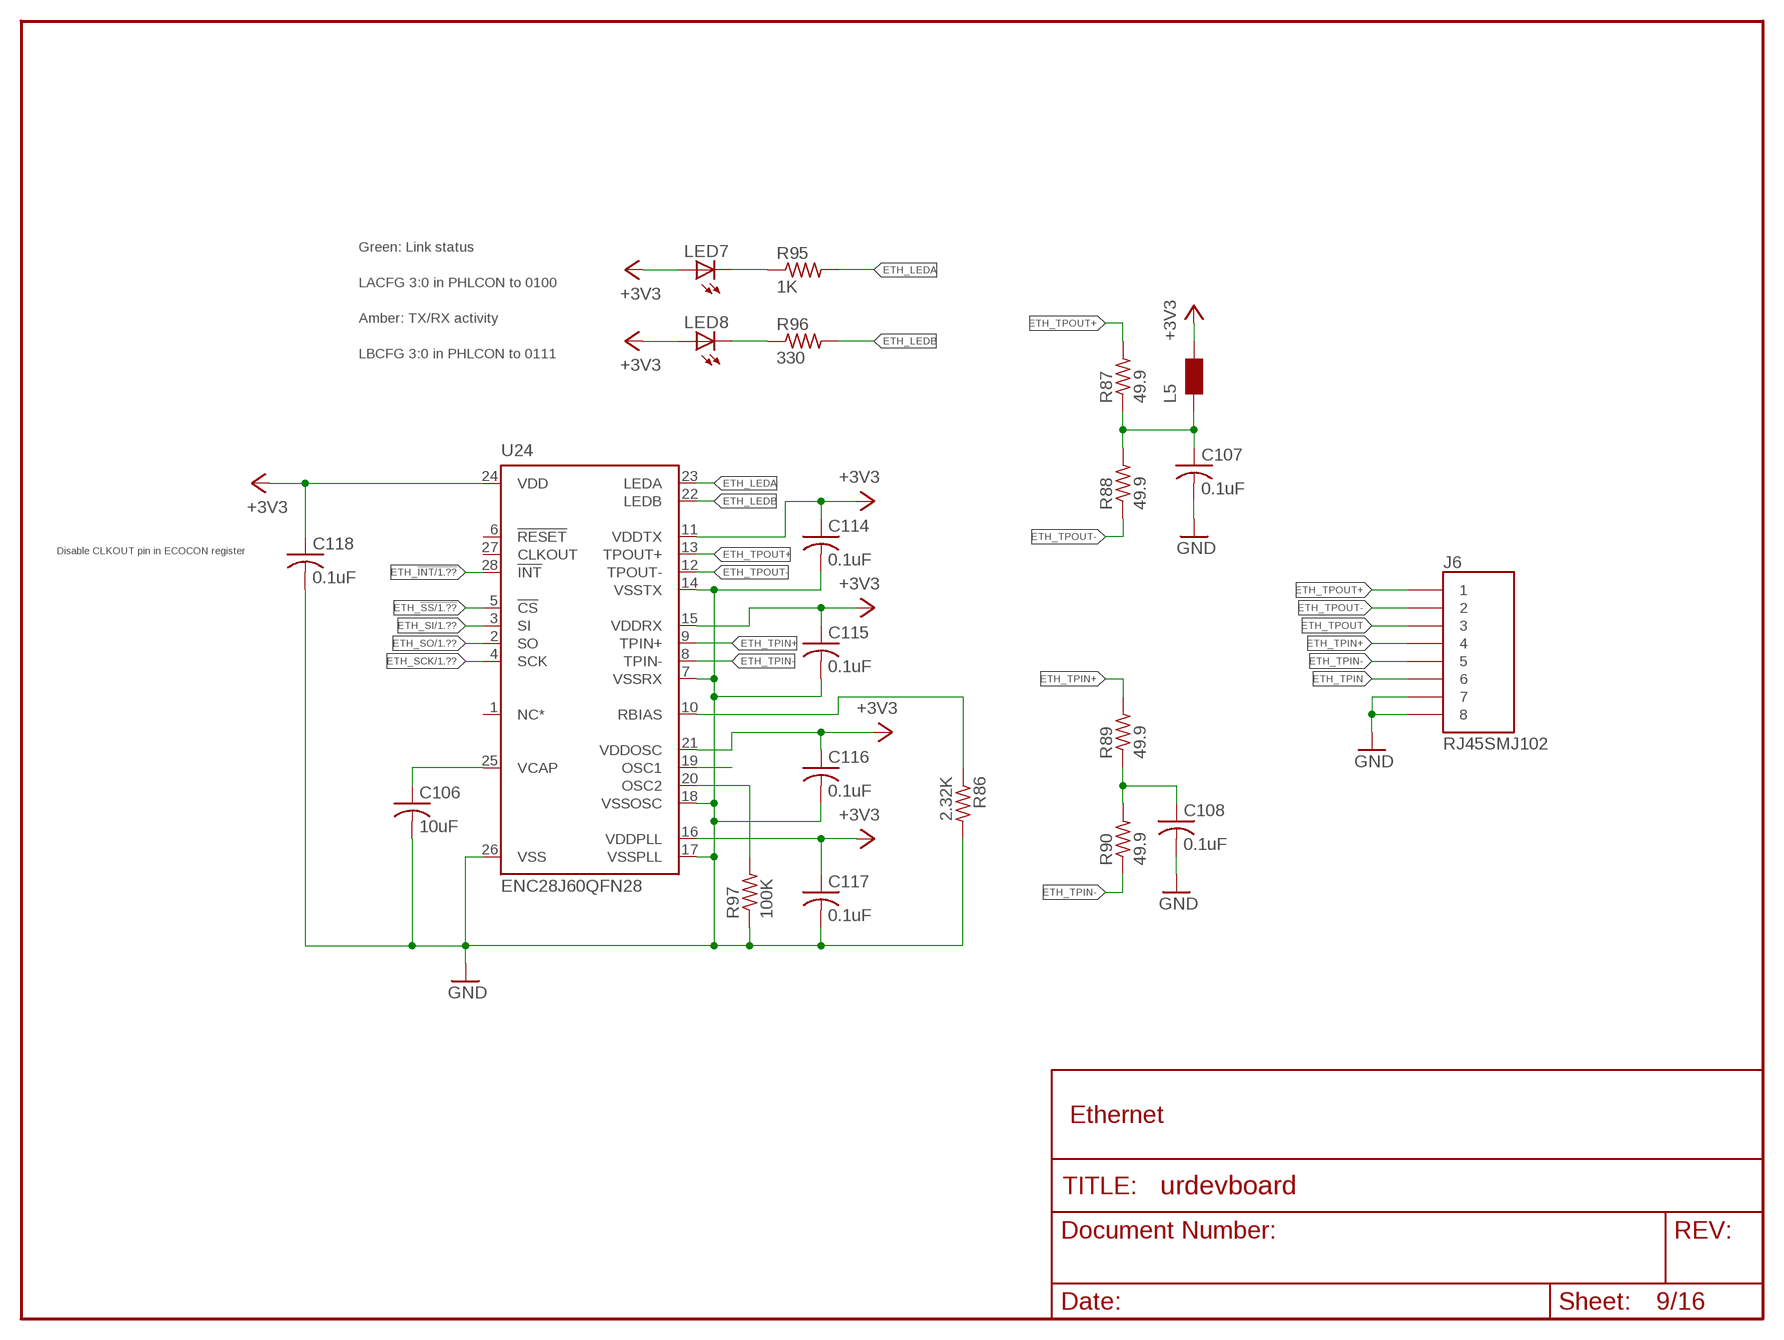
[diagram p8: schematic, sheet 9]

### Parts
C106  10uF  C-USC0805  [C0805]
C107  0.1uF  C-USC0402  [C0402]
C108  0.1uF  C-USC0402  [C0402]
C114  0.1uF  C-USC0402  [C0402]
C115  0.1uF  C-USC0402  [C0402]
C116  0.1uF  C-USC0402  [C0402]
C117  0.1uF  C-USC0402  [C0402]
C118  0.1uF  C-USC0402  [C0402]
J6  RJ45SMJ102  [SMJ102-S88I-DS-11]
L5  WE-CBF_0402  [0402]
LED7  LEDCHIPLED_0603  [CHIPLED_0603]
LED8  LEDCHIPLED_0603  [CHIPLED_0603]
R86  2.32K  R-US_R0402  [R0402]
R87  49.9  R-US_R0402  [R0402]
R88  49.9  R-US_R0402  [R0402]
R89  49.9  R-US_R0402  [R0402]
R90  49.9  R-US_R0402  [R0402]
R95  1K  R-US_R0603  [R0603]
R96  330  R-US_R0603  [R0603]
R97  100K  R-US_R0402  [R0402]
U24  ENC28J60QFN28  [QFN28-ML_6X6MM]

### Nets
+3V3: C114.1 C115.1 C116.1 C117.1 C118.1 L5.2 LED7.A LED8.A U24.11(VDDTX) U24.15(VDDRX) U24.16(VDDPLL) U24.21(VDDOSC) U24.24(VDD) ; also sheet 1,2,3,4,5,6,7,8,10,11,16
ETH_!INT: U24.28(!INT) ; also sheet 1
ETH_!SS: U24.5(!CS) ; also sheet 1
ETH_LEDA: R95.2 U24.23(LEDA)
ETH_LEDB: R96.2 U24.22(LEDB)
ETH_OSC1: U24.19(OSC1) ; also sheet 1
ETH_OSC2: R97.2 U24.20(OSC2)
ETH_RBIAS: R86.1 U24.10(RBIAS)
ETH_SCK: U24.4(SCK) ; also sheet 1
ETH_SI: U24.3(SI) ; also sheet 1
ETH_SO: U24.2(SO) ; also sheet 1
ETH_TPIN: C108.1 J6.6 R89.1 R90.2
ETH_TPIN+: J6.4 R89.2 U24.9(TPIN+)
ETH_TPIN-: J6.5 R90.1 U24.8(TPIN-)
ETH_TPOUT: C107.1 J6.3 L5.1 R87.1 R88.2
ETH_TPOUT+: J6.1 R87.2 U24.13(TPOUT+)
ETH_TPOUT-: J6.2 R88.1 U24.12(TPOUT-)
ETH_VCAP: C106.1 U24.25(VCAP)
GND: C106.2 C107.2 C108.2 C114.2 C115.2 C116.2 C117.2 C118.2 J6.7 J6.8 R86.2 R97.1 U24.7(VSSRX) U24.14(VSSTX) U24.17(VSSPLL) U24.18(VSSOSC) U24.26(VSS) ; also sheet 1,2,3,4,5,6,7,8,10,11,12,13,14,15,16
LED7: LED7.C R95.1
LED8: LED8.C R96.1
Unconnected: U24.1(NC*) U24.6(!RESET) U24.27(CLKOUT)

### Notes on the sheet
- Green: Link status
- LACFG 3:0 in PHLCON to 0100
- Amber: TX/RX activity
- LBCFG 3:0 in PHLCON to 0111
- Disable CLKOUT pin in ECOCON register
- Ethernet

## Sheet 10 of 16
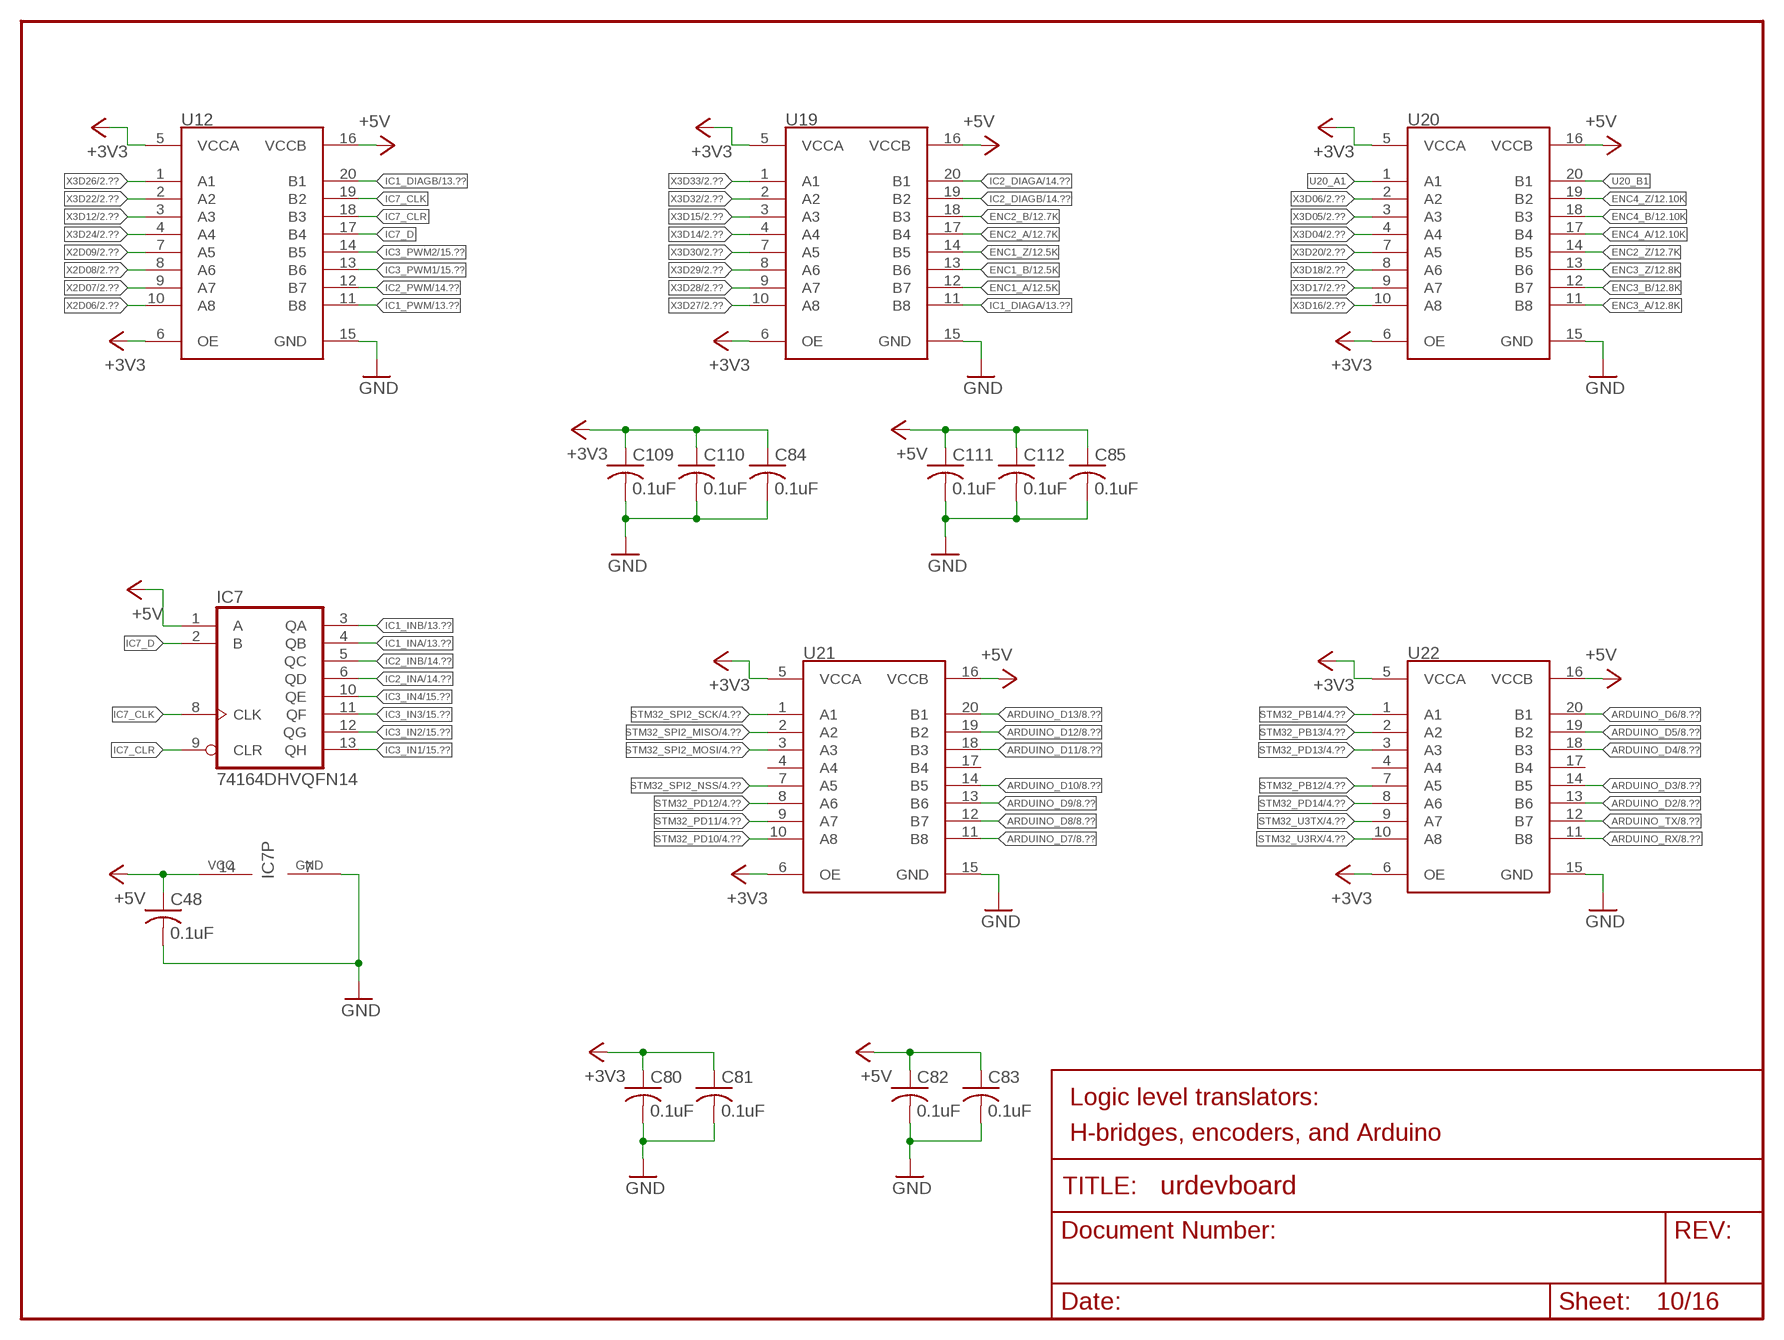
[diagram p9: schematic, sheet 10]

### Parts
C48  0.1uF  C-USC0402  [C0402]
C80  0.1uF  C-USC0402  [C0402]
C81  0.1uF  C-USC0402  [C0402]
C82  0.1uF  C-USC0402  [C0402]
C83  0.1uF  C-USC0402  [C0402]
C84  0.1uF  C-USC0402  [C0402]
C85  0.1uF  C-USC0402  [C0402]
C109  0.1uF  C-USC0402  [C0402]
C110  0.1uF  C-USC0402  [C0402]
C111  0.1uF  C-USC0402  [C0402]
C112  0.1uF  C-USC0402  [C0402]
IC7  74164DHVQFN14  [DHVQFN14]
U12  TXB0108DQS  [DQS_R-PUSON-N20]
U19  TXB0108DQS  [DQS_R-PUSON-N20]
U20  TXB0108DQS  [DQS_R-PUSON-N20]
U21  TXB0108DQS  [DQS_R-PUSON-N20]
U22  TXB0108DQS  [DQS_R-PUSON-N20]

### Nets
+3V3: C80.1 C81.1 C84.1 C109.1 C110.1 U12.5(VCCA) U12.6(OE) U19.5(VCCA) U19.6(OE) U20.5(VCCA) U20.6(OE) U21.5(VCCA) U21.6(OE) U22.5(VCCA) U22.6(OE) ; also sheet 1,2,3,4,5,6,7,8,9,11,16
+5V: C48.1 C82.1 C83.1 C85.1 C111.1 C112.1 IC7.1(A) IC7.14(VCC) U12.16(VCCB) U19.16(VCCB) U20.16(VCCB) U21.16(VCCB) U22.16(VCCB) ; also sheet 3,4,6,7,8,12,13,14,15
ARDUINO_D2: U22.13(B6) ; also sheet 8
ARDUINO_D3: U22.14(B5) ; also sheet 8
ARDUINO_D4: U22.18(B3) ; also sheet 8
ARDUINO_D5: U22.19(B2) ; also sheet 8
ARDUINO_D6: U22.20(B1) ; also sheet 8
ARDUINO_D7: U21.11(B8) ; also sheet 8
ARDUINO_D8: U21.12(B7) ; also sheet 8
ARDUINO_D9: U21.13(B6) ; also sheet 8
ARDUINO_D10: U21.14(B5) ; also sheet 8
ARDUINO_D11: U21.18(B3) ; also sheet 8
ARDUINO_D12: U21.19(B2) ; also sheet 8
ARDUINO_D13: U21.20(B1) ; also sheet 8
ARDUINO_RX: U22.11(B8) ; also sheet 8
ARDUINO_TX: U22.12(B7) ; also sheet 8
ENC1_A: U19.12(B7) ; also sheet 12
ENC1_B: U19.13(B6) ; also sheet 12
ENC1_Z: U19.14(B5) ; also sheet 12
ENC2_A: U19.17(B4) ; also sheet 12
ENC2_B: U19.18(B3) ; also sheet 12
ENC2_Z: U20.14(B5) ; also sheet 12
ENC3_A: U20.11(B8) ; also sheet 12
ENC3_B: U20.12(B7) ; also sheet 12
ENC3_Z: U20.13(B6) ; also sheet 12
ENC4_A: U20.17(B4) ; also sheet 12
ENC4_B: U20.18(B3) ; also sheet 12
ENC4_Z: U20.19(B2) ; also sheet 12
GND: C48.2 C80.2 C81.2 C82.2 C83.2 C84.2 C85.2 C109.2 C110.2 C111.2 C112.2 IC7.7(GND) U12.15(GND) U19.15(GND) U20.15(GND) U21.15(GND) U22.15(GND) ; also sheet 1,2,3,4,5,6,7,8,9,11,12,13,14,15,16
IC1_DIAGA: U19.11(B8) ; also sheet 13
IC1_DIAGB: U12.20(B1) ; also sheet 13
IC1_INA: IC7.4(QB) ; also sheet 13
IC1_INB: IC7.3(QA) ; also sheet 13
IC1_PWM: U12.11(B8) ; also sheet 13
IC2_DIAGA: U19.20(B1) ; also sheet 14
IC2_DIAGB: U19.19(B2) ; also sheet 14
IC2_INA: IC7.6(QD) ; also sheet 14
IC2_INB: IC7.5(QC) ; also sheet 14
IC2_PWM: U12.12(B7) ; also sheet 14
IC3_IN1: IC7.13(QH) ; also sheet 15
IC3_IN2: IC7.12(QG) ; also sheet 15
IC3_IN3: IC7.11(QF) ; also sheet 15
IC3_IN4: IC7.10(QE) ; also sheet 15
IC3_PWM1: U12.13(B6) ; also sheet 15
IC3_PWM2: U12.14(B5) ; also sheet 15
IC7_CLK: IC7.8(CLK) U12.19(B2)
IC7_CLR: IC7.9(CLR) U12.18(B3)
IC7_D: IC7.2(B) U12.17(B4)
STM32_PB12: U22.7(A5) ; also sheet 4
STM32_PB13: U22.2(A2) ; also sheet 4
STM32_PB14: U22.1(A1) ; also sheet 4
STM32_PD10: U21.10(A8) ; also sheet 4
STM32_PD11: U21.9(A7) ; also sheet 4
STM32_PD12: U21.8(A6) ; also sheet 4
STM32_PD13: U22.3(A3) ; also sheet 4
STM32_PD14: U22.8(A6) ; also sheet 4
STM32_SPI2_MISO: U21.2(A2) ; also sheet 4
STM32_SPI2_MOSI: U21.3(A3) ; also sheet 4
STM32_SPI2_NSS: U21.7(A5) ; also sheet 4
STM32_SPI2_SCK: U21.1(A1) ; also sheet 4
STM32_U3RX: U22.10(A8) ; also sheet 4
STM32_U3TX: U22.9(A7) ; also sheet 4
U20_A1: U20.1(A1)
U20_B1: U20.20(B1)
X2D06: U12.10(A8) ; also sheet 2
X2D07: U12.9(A7) ; also sheet 2
X2D08: U12.8(A6) ; also sheet 2
X2D09: U12.7(A5) ; also sheet 2
X3D04: U20.4(A4) ; also sheet 2
X3D05: U20.3(A3) ; also sheet 2
X3D06: U20.2(A2) ; also sheet 2
X3D12: U12.3(A3) ; also sheet 2
X3D14: U19.4(A4) ; also sheet 2
X3D15: U19.3(A3) ; also sheet 2
X3D16: U20.10(A8) ; also sheet 2
X3D17: U20.9(A7) ; also sheet 2
X3D18: U20.8(A6) ; also sheet 2
X3D20: U20.7(A5) ; also sheet 2
X3D22: U12.2(A2) ; also sheet 2
X3D24: U12.4(A4) ; also sheet 2
X3D26: U12.1(A1) ; also sheet 2
X3D27: U19.10(A8) ; also sheet 2
X3D28: U19.9(A7) ; also sheet 2
X3D29: U19.8(A6) ; also sheet 2
X3D30: U19.7(A5) ; also sheet 2
X3D32: U19.2(A2) ; also sheet 2
X3D33: U19.1(A1) ; also sheet 2
Unconnected: U21.4(A4) U21.17(B4) U22.4(A4) U22.17(B4)

### Notes on the sheet
- Logic level translators:
- H-bridges, encoders, and Arduino

## Sheet 11 of 16
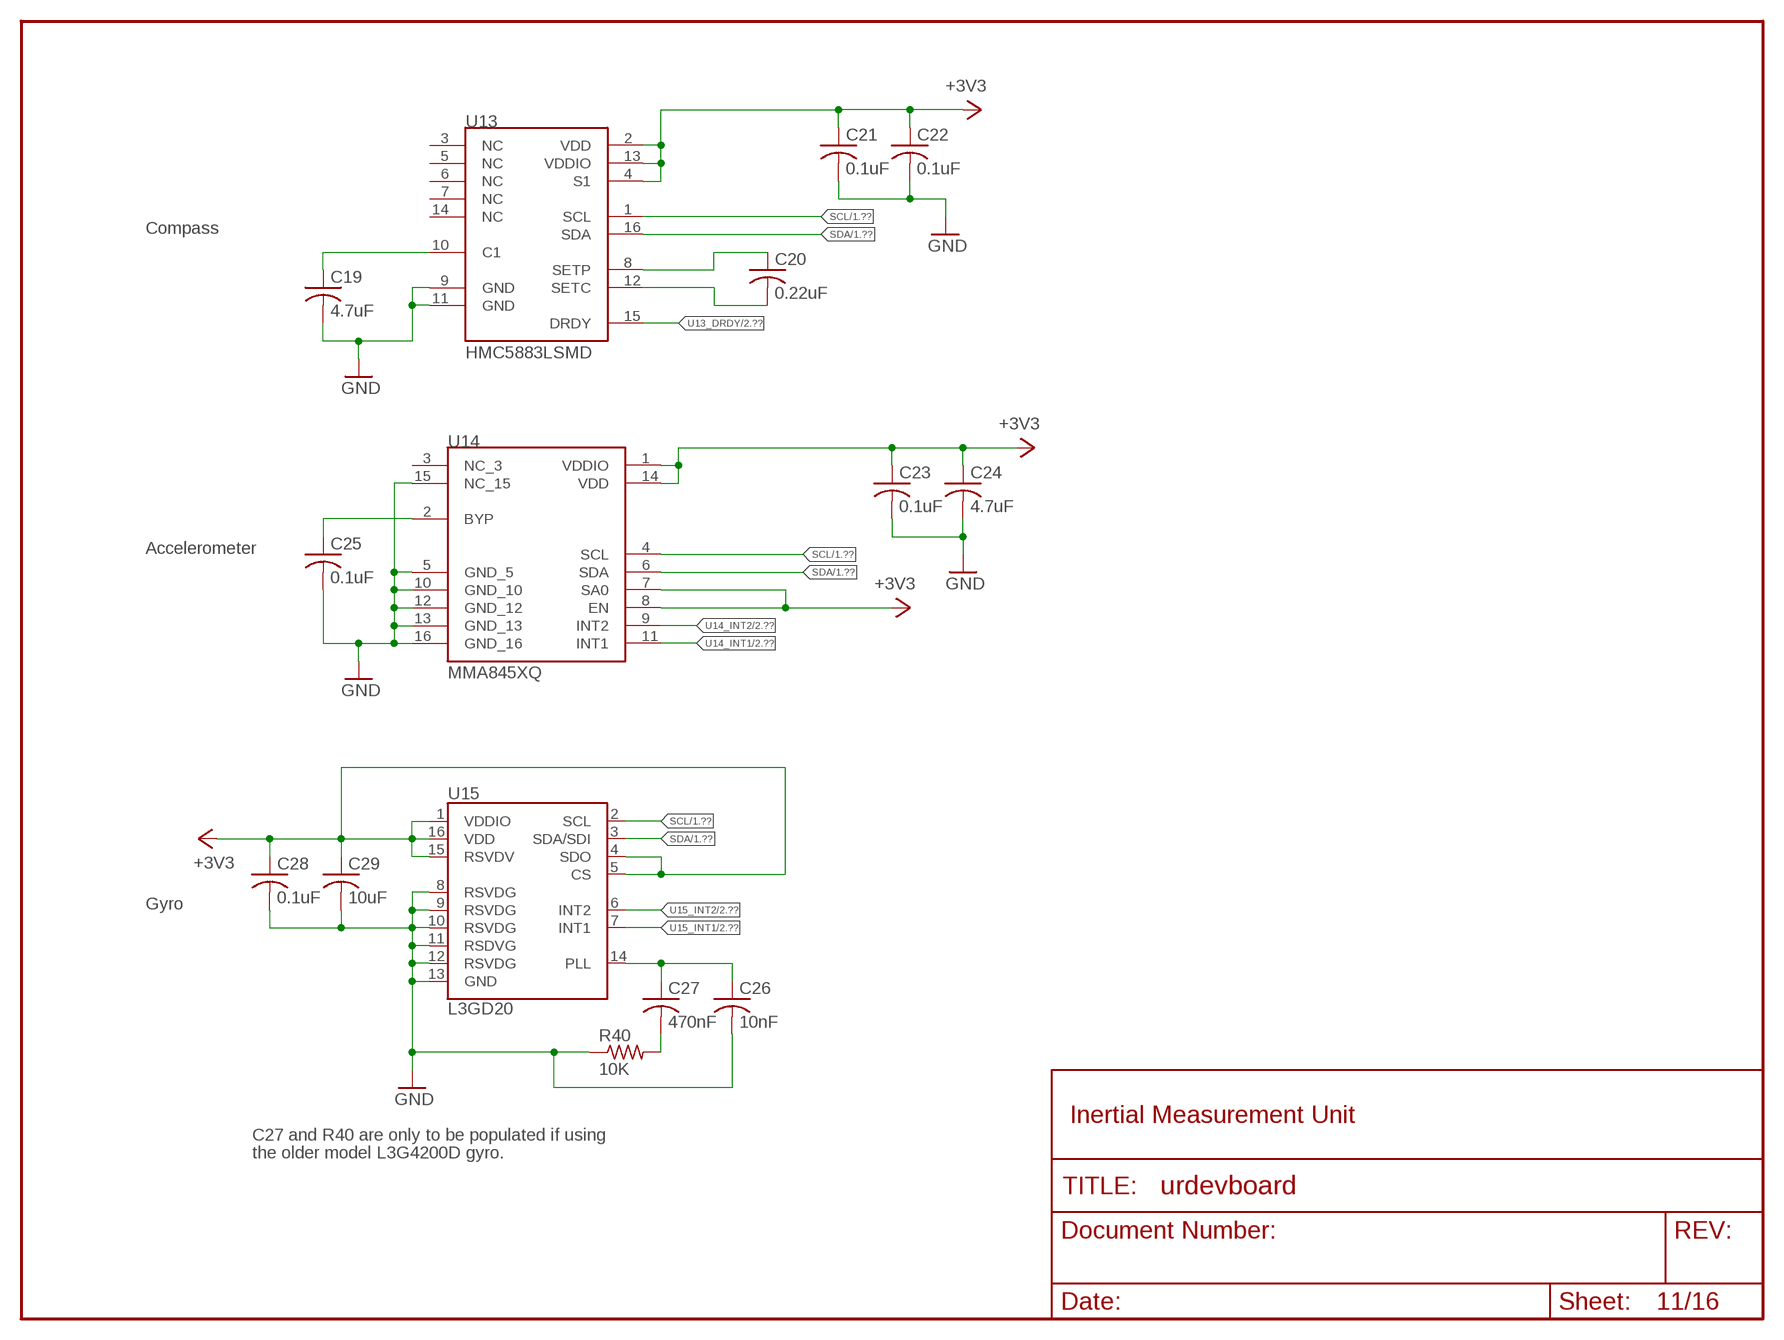
[diagram p10: schematic, sheet 11]

### Parts
C19  4.7uF  C-USC0805  [C0805]
C20  0.22uF  C-USC0603  [C0603]
C21  0.1uF  C-USC0603  [C0603]
C22  0.1uF  C-USC0603  [C0603]
C23  0.1uF  C-USC0603  [C0603]
C24  4.7uF  C-USC0805  [C0805]
C25  0.1uF  C-USC0603  [C0603]
C26  10nF  C-USC0603  [C0603]
C27  470nF  C-USC0603  [C0603]
C28  0.1uF  C-USC0603  [C0603]
C29  10uF  C-USC0805  [C0805]
R40  10K  R-US_R0603  [R0603]
U13  HMC5883LSMD  [16LPCC]
U14  MMA845XQ  [VQFN-16]
U15  L3GD20  L3G4200D  [LGA16-4X4]

### Nets
+3V3: C21.1 C22.1 C23.1 C24.1 C28.1 C29.1 U13.2(VDD) U13.4(S1) U13.13(VDDIO) U14.1(VDDIO) U14.7(SA0) U14.8(EN) U14.14(VDD) U15.1(VDDIO) U15.4(SDO) U15.5(CS) U15.15(RSVDV) U15.16(VDD) ; also sheet 1,2,3,4,5,6,7,8,9,10,16
C27_R40: C27.2 R40.2
GND: C19.2 C21.2 C22.2 C23.2 C24.2 C25.2 C26.2 C28.2 C29.2 R40.1 U13.9(GND) U13.11(GND) U14.5(GND_5) U14.10(GND_10) U14.12(GND_12) U14.13(GND_13) U14.15(NC_15) U14.16(GND_16) U15.8(RSVDG) U15.9(RSVDG) U15.10(RSVDG) U15.11(RSDVG) U15.12(RSVDG) U15.13(GND) ; also sheet 1,2,3,4,5,6,7,8,9,10,12,13,14,15,16
SCL: U13.1(SCL) U14.4(SCL) U15.2(SCL) ; also sheet 1,2,8
SDA: U13.16(SDA) U14.6(SDA) U15.3(SDA/SDI) ; also sheet 1,2,8
U13_C1: C19.1 U13.10(C1)
U13_DRDY: U13.15(DRDY) ; also sheet 2
U13_SETC: C20.2 U13.12(SETC)
U13_SETP: C20.1 U13.8(SETP)
U14_BYP: C25.1 U14.2(BYP)
U14_INT1: U14.11(INT1) ; also sheet 2
U14_INT2: U14.9(INT2) ; also sheet 2
U15_INT1: U15.7(INT1) ; also sheet 2
U15_INT2: U15.6(INT2) ; also sheet 2
U15_PLL: C26.1 C27.1 U15.14(PLL)
Unconnected: U13.3(NC) U13.5(NC) U13.6(NC) U13.7(NC) U13.14(NC) U14.3(NC_3)

### Notes on the sheet
- Compass
- Accelerometer
- Gyro
- Inertial Measurement Unit
- C27 and R40 are only to be populated if using
- the older model L3G4200D gyro.

## Sheet 12 of 16
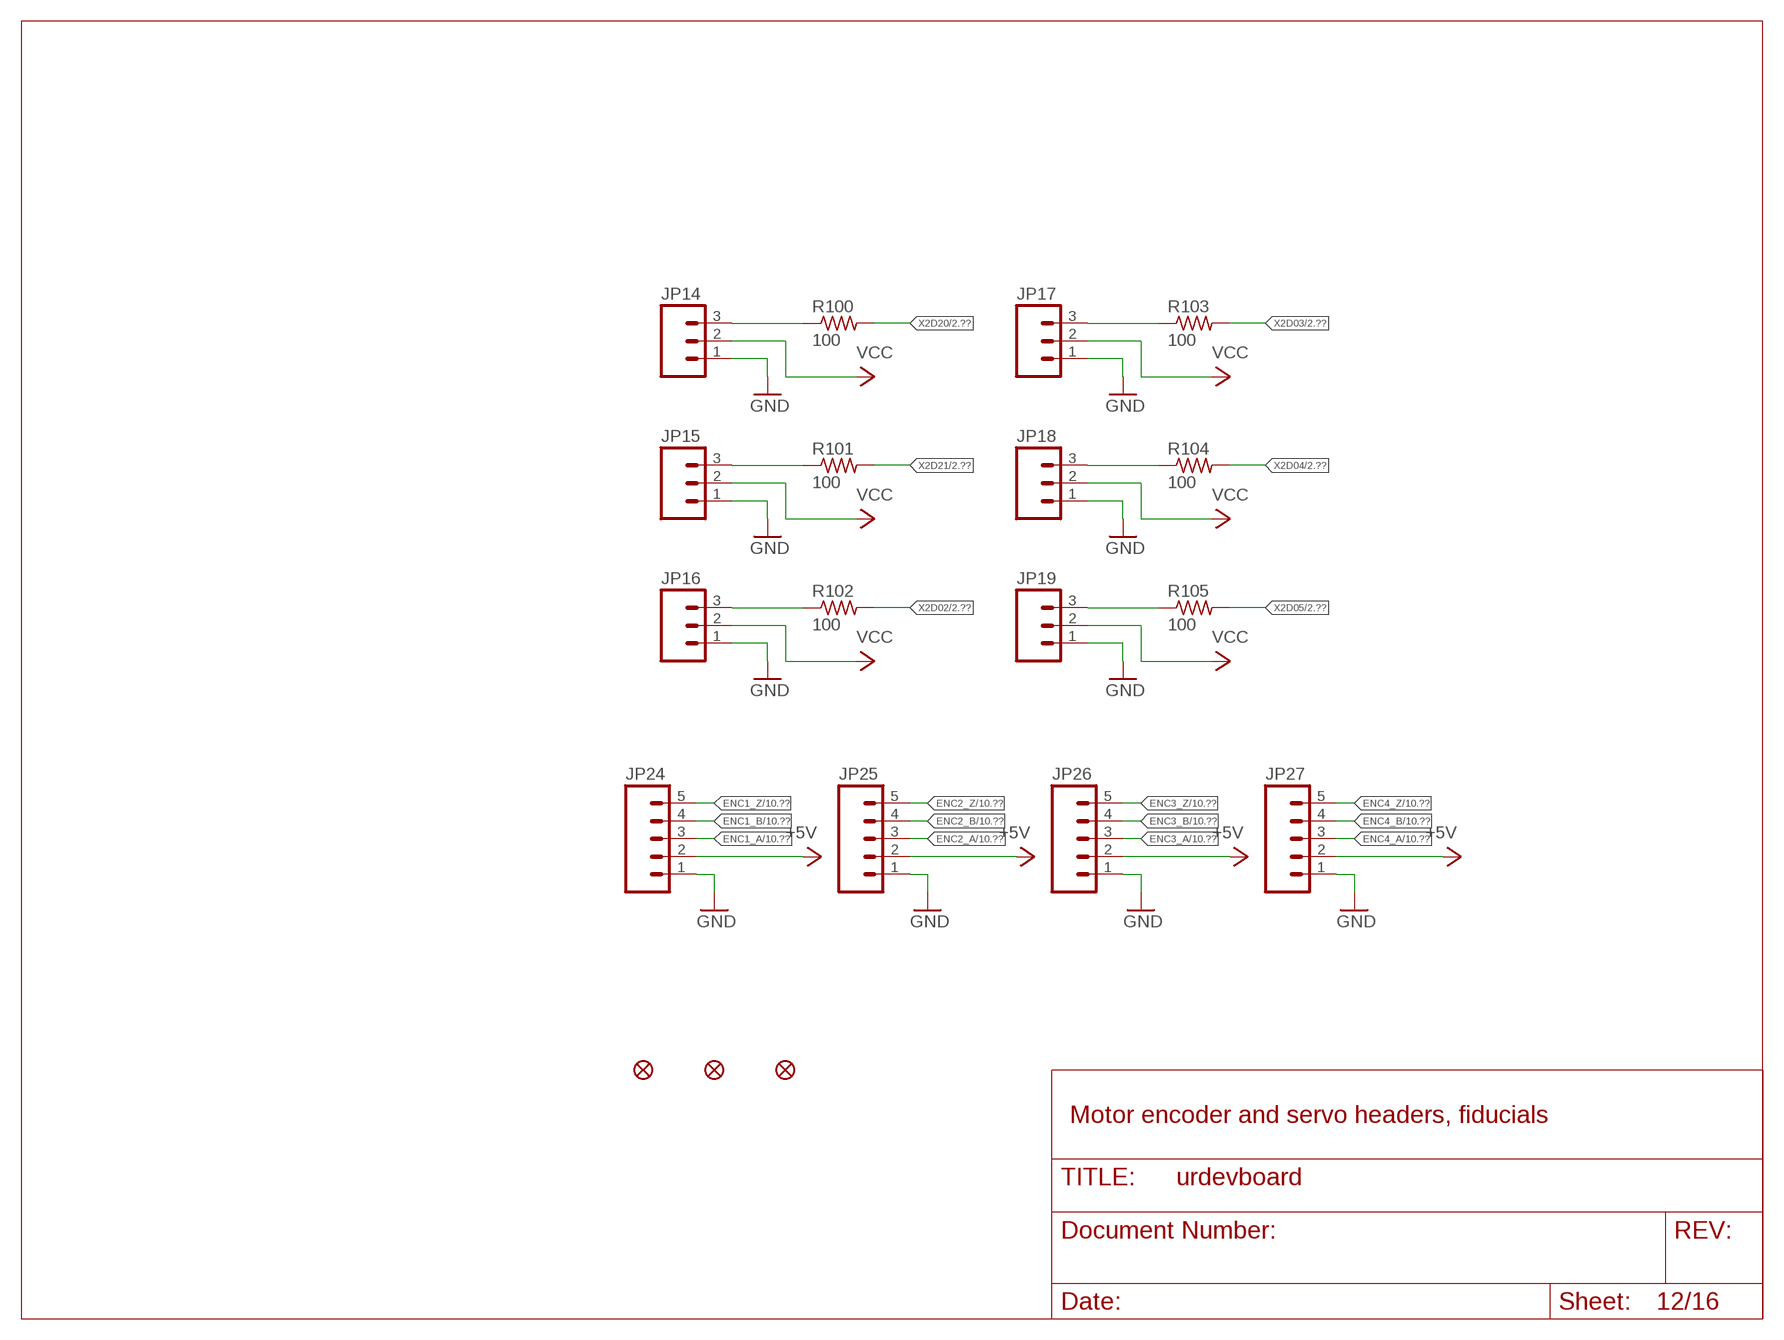
[diagram p11: schematic, sheet 12]

### Parts
JP14  M03PTH  [1X03]
JP15  M03PTH  [1X03]
JP16  M03PTH  [1X03]
JP17  M03PTH  [1X03]
JP18  M03PTH  [1X03]
JP19  M03PTH  [1X03]
JP24  M05PTH  [1X05]
JP25  M05PTH  [1X05]
JP26  M05PTH  [1X05]
JP27  M05PTH  [1X05]
JP29  FIDUCIAL1X2  [FIDUCIAL-1X2]
JP30  FIDUCIAL1X2  [FIDUCIAL-1X2]
JP31  FIDUCIAL1X2  [FIDUCIAL-1X2]
R100  100  R-US_R0402  [R0402]
R101  100  R-US_R0402  [R0402]
R102  100  R-US_R0402  [R0402]
R103  100  R-US_R0402  [R0402]
R104  100  R-US_R0402  [R0402]
R105  100  R-US_R0402  [R0402]

### Nets
+5V: JP24.2 JP25.2 JP26.2 JP27.2 ; also sheet 3,4,6,7,8,10,13,14,15
ENC1_A: JP24.3 ; also sheet 10
ENC1_B: JP24.4 ; also sheet 10
ENC1_Z: JP24.5 ; also sheet 10
ENC2_A: JP25.3 ; also sheet 10
ENC2_B: JP25.4 ; also sheet 10
ENC2_Z: JP25.5 ; also sheet 10
ENC3_A: JP26.3 ; also sheet 10
ENC3_B: JP26.4 ; also sheet 10
ENC3_Z: JP26.5 ; also sheet 10
ENC4_A: JP27.3 ; also sheet 10
ENC4_B: JP27.4 ; also sheet 10
ENC4_Z: JP27.5 ; also sheet 10
GND: JP14.1 JP15.1 JP16.1 JP17.1 JP18.1 JP19.1 JP24.1 JP25.1 JP26.1 JP27.1 ; also sheet 1,2,3,4,5,6,7,8,9,10,11,13,14,15,16
SERVO_0: JP14.3 R100.1
SERVO_1: JP15.3 R101.1
SERVO_2: JP16.3 R102.1
SERVO_3: JP17.3 R103.1
SERVO_4: JP18.3 R104.1
SERVO_5: JP19.3 R105.1
VCC: JP14.2 JP15.2 JP16.2 JP17.2 JP18.2 JP19.2 ; also sheet 7
X2D02: R102.2 ; also sheet 2
X2D03: R103.2 ; also sheet 2
X2D04: R104.2 ; also sheet 2
X2D05: R105.2 ; also sheet 2
X2D20: R100.2 ; also sheet 2
X2D21: R101.2 ; also sheet 2

### Notes on the sheet
- Motor encoder and servo headers, fiducials

## Sheet 13 of 16
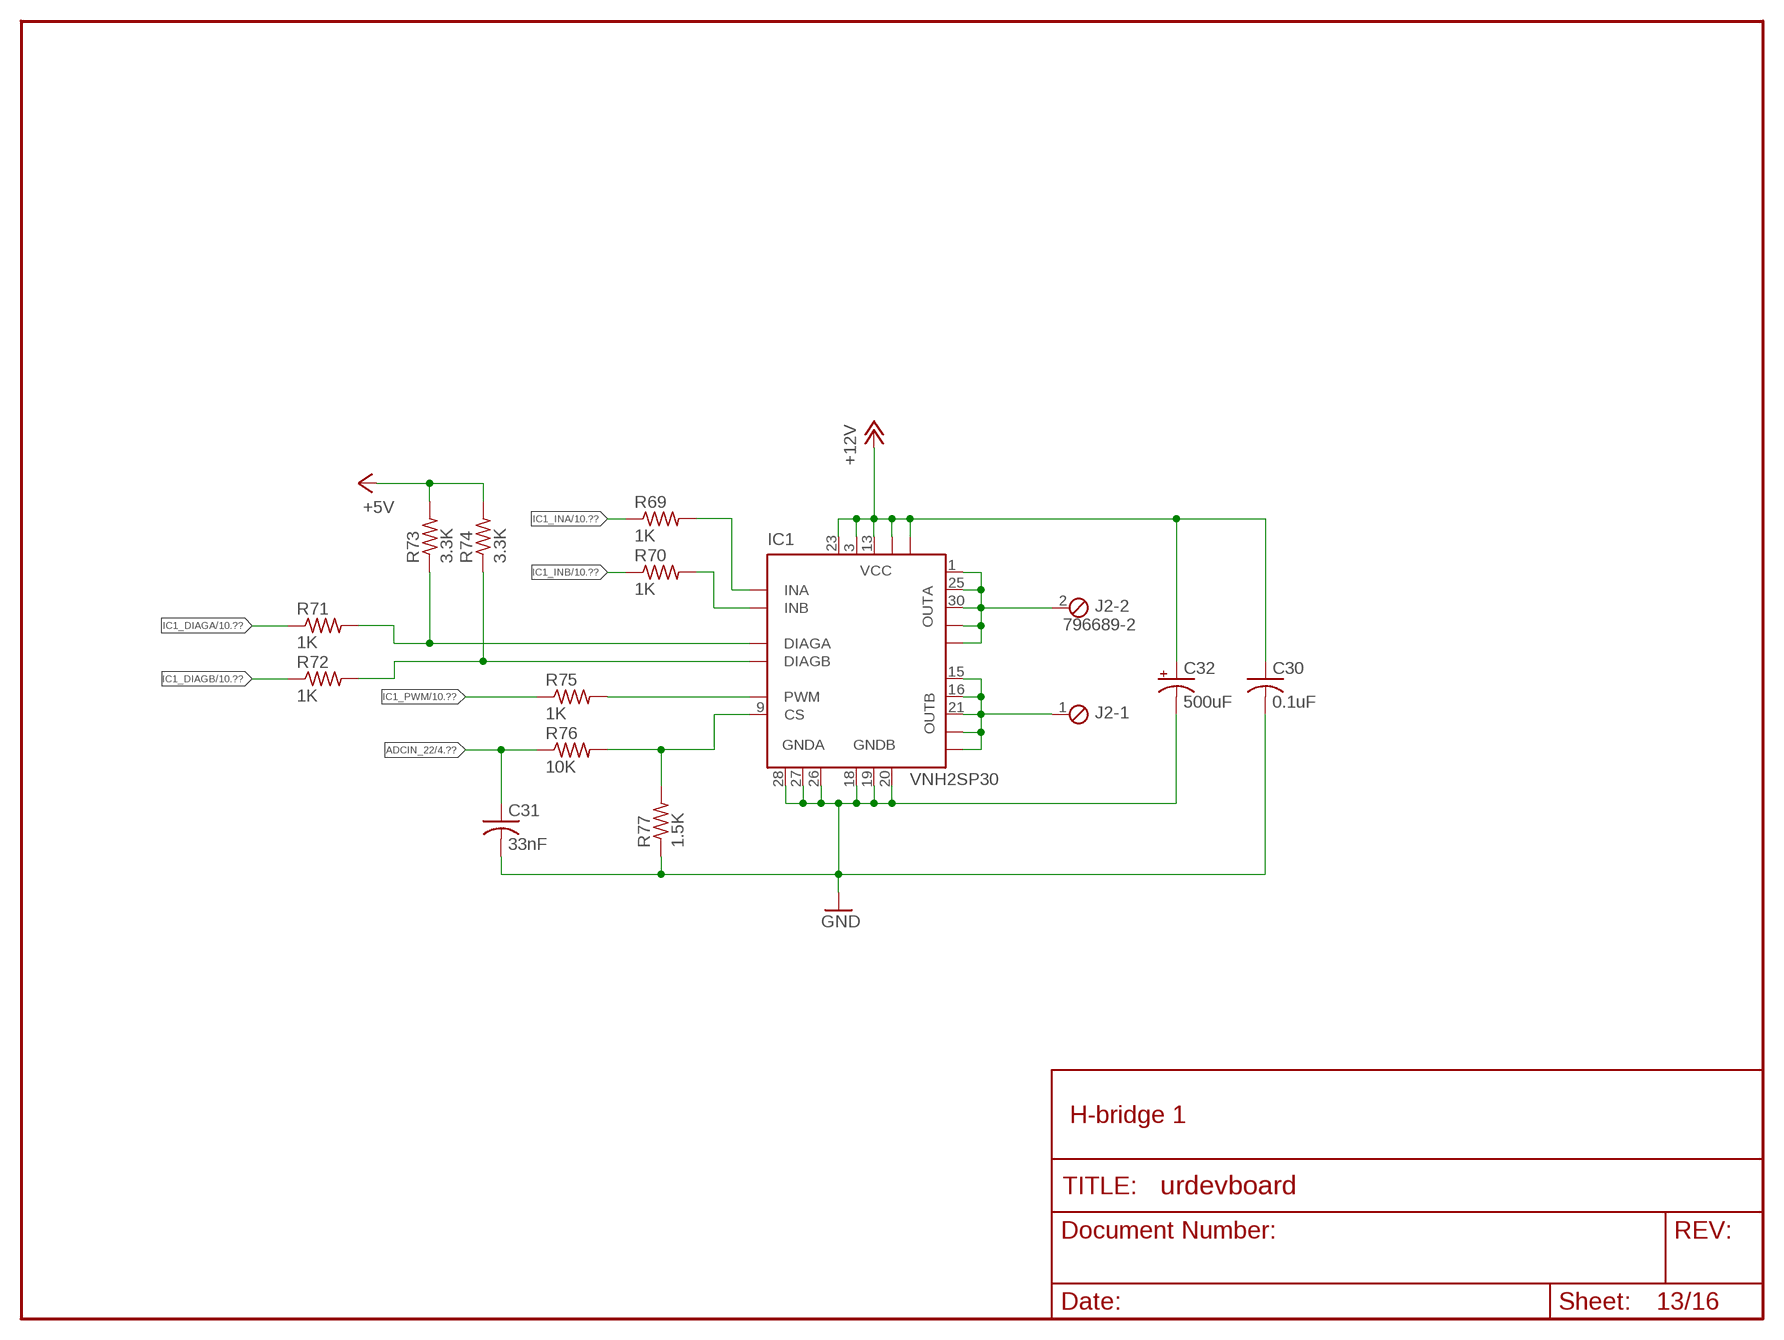
[diagram p12: schematic, sheet 13]

### Parts
C30  0.1uF  C-USC0603  [C0603]
C31  33nF  C-USC0603  [C0603]
C32  500uF  CPOL-USE2.5-6  [E2,5-6]
IC1  VNH2SP30  [MULTIPOWERSO-30]
J2  796689-2  [796689-2]
R69  1K  R-US_R0402  [R0402]
R70  1K  R-US_R0402  [R0402]
R71  1K  R-US_R0402  [R0402]
R72  1K  R-US_R0402  [R0402]
R73  3.3K  R-US_R0402  [R0402]
R74  3.3K  R-US_R0402  [R0402]
R75  1K  R-US_R0402  [R0402]
R76  10K  R-US_R0402  [R0402]
R77  1.5K  R-US_R0402  [R0402]

### Nets
+5V: R73.2 R74.2 ; also sheet 3,4,6,7,8,10,12,14,15
+12V: C30.1 C32.+ IC1.3(VCC) IC1.13(VCC) IC1.23(VCC) IC1.VCC IC1.VCC@1(VCC) ; also sheet 7,8,14,15,16
ADCIN_22: C31.1 R76.1 ; also sheet 4
GND: C30.2 C31.2 C32.- IC1.18(GNDB) IC1.19(GNDB) IC1.20(GNDB) IC1.26(GNDA) IC1.27(GNDA) IC1.28(GNDA) R77.1 ; also sheet 1,2,3,4,5,6,7,8,9,10,11,12,14,15,16
IC1_CS: IC1.9(CS) R76.2 R77.2
IC1_DIAGA: R71.1 ; also sheet 10
IC1_DIAGB: R72.1 ; also sheet 10
IC1_INA: R69.1 ; also sheet 10
IC1_INB: R70.1 ; also sheet 10
IC1_OUTA: IC1.1(OUTA) IC1.25(OUTA) IC1.30(OUTA) IC1.OUTA IC1.OUTA@1(OUTA) J2.2
IC1_OUTB: IC1.15(OUTB) IC1.16(OUTB) IC1.21(OUTB) IC1.OUTB IC1.OUTB@1(OUTB) J2.1
IC1_PWM: R75.1 ; also sheet 10
R69_IC1: IC1.5(INA) R69.2
R70_IC1: IC1.11(INB) R70.2
R71_IC1: IC1.6(DIAGA) R71.2 R73.1
R72_IC1: IC1.10(DIAGB) R72.2 R74.1
R75_IC1: IC1.8(PWM) R75.2

### Notes on the sheet
- H-bridge 1

## Sheet 14 of 16
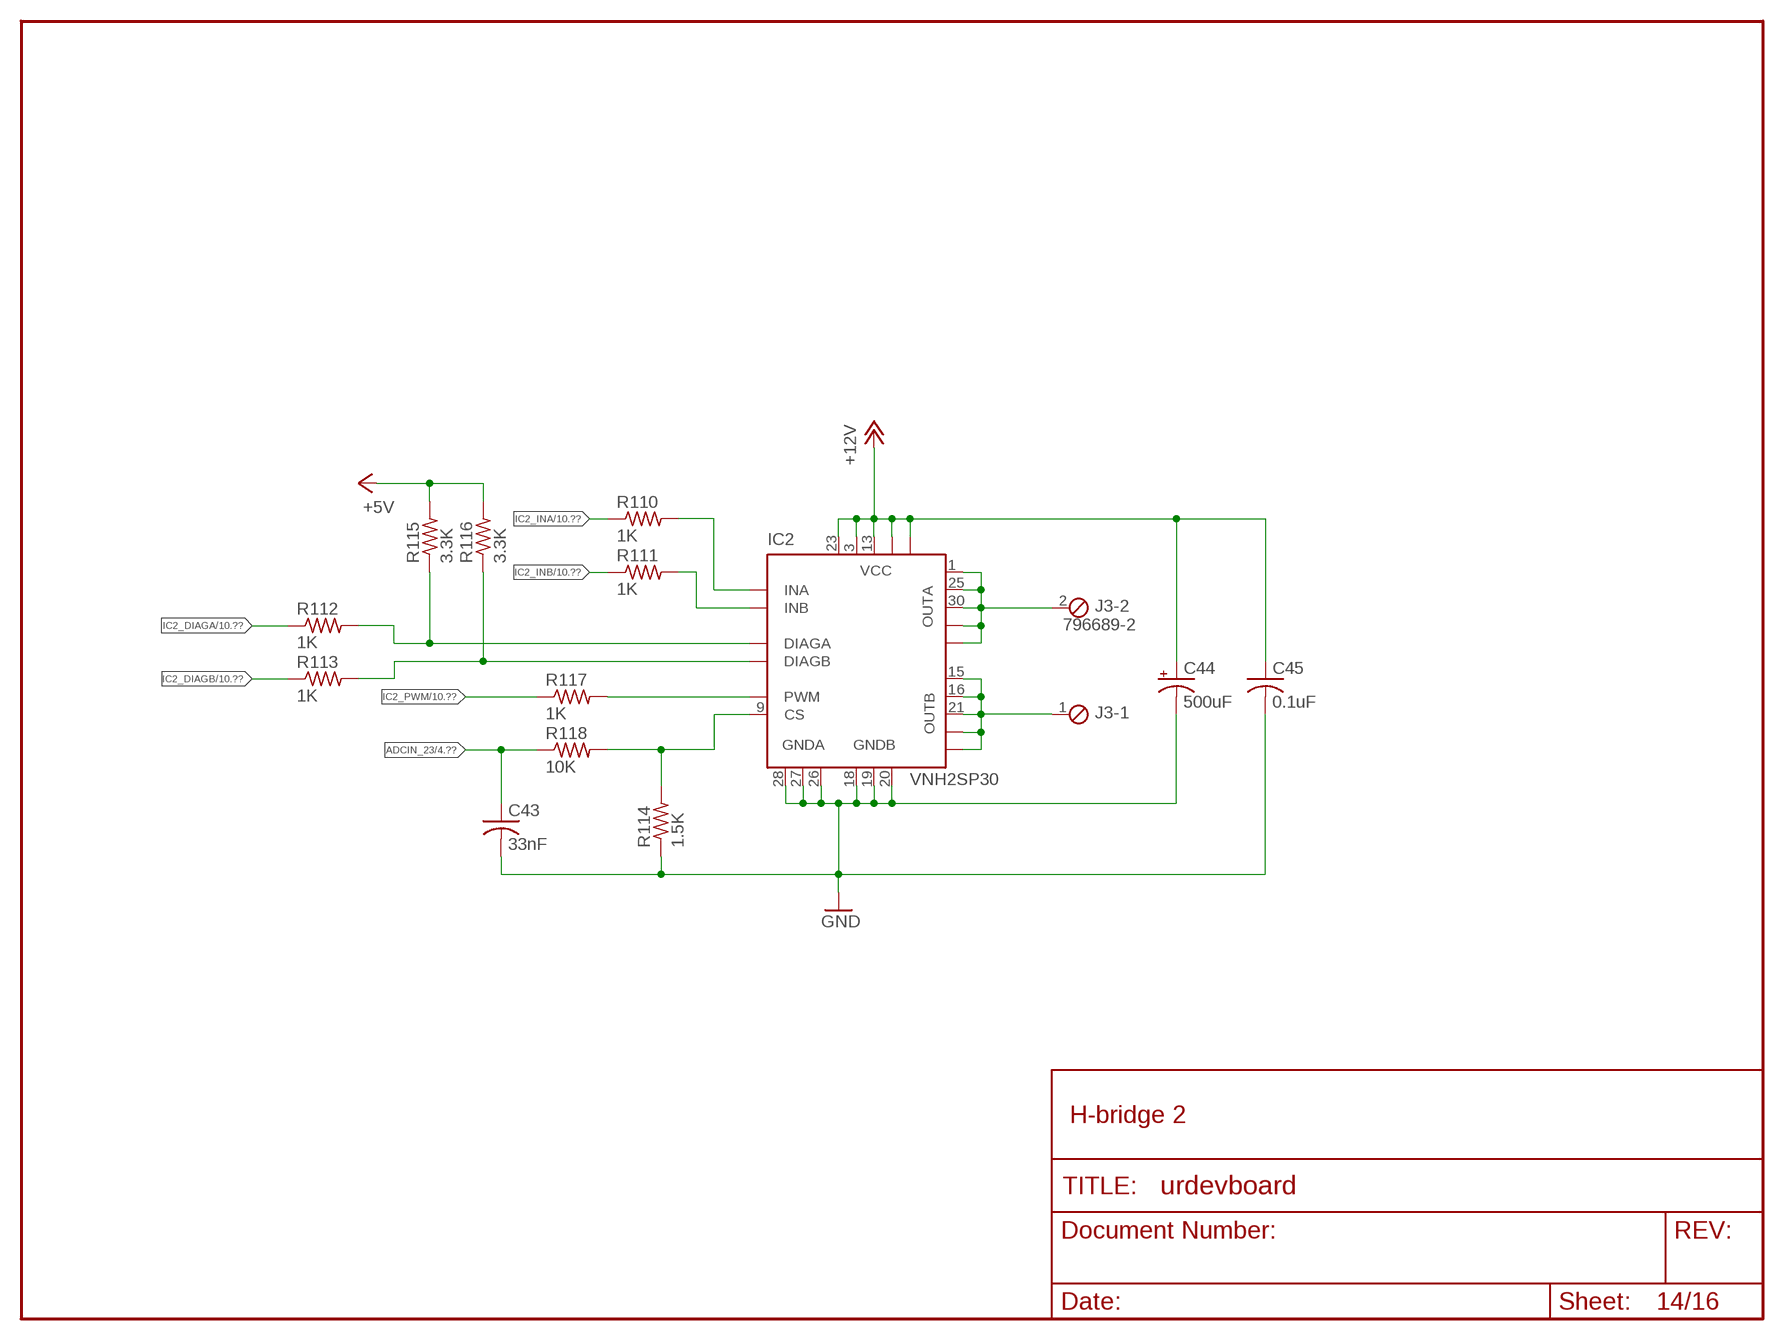
[diagram p13: schematic, sheet 14]

### Parts
C43  33nF  C-USC0603  [C0603]
C44  500uF  CPOL-USE2.5-6  [E2,5-6]
C45  0.1uF  C-USC0603  [C0603]
IC2  VNH2SP30  [MULTIPOWERSO-30]
J3  796689-2  [796689-2]
R110  1K  R-US_R0402  [R0402]
R111  1K  R-US_R0402  [R0402]
R112  1K  R-US_R0402  [R0402]
R113  1K  R-US_R0402  [R0402]
R114  1.5K  R-US_R0402  [R0402]
R115  3.3K  R-US_R0402  [R0402]
R116  3.3K  R-US_R0402  [R0402]
R117  1K  R-US_R0402  [R0402]
R118  10K  R-US_R0402  [R0402]

### Nets
+5V: R115.2 R116.2 ; also sheet 3,4,6,7,8,10,12,13,15
+12V: C44.+ C45.1 IC2.3(VCC) IC2.13(VCC) IC2.23(VCC) IC2.VCC IC2.VCC@1(VCC) ; also sheet 7,8,13,15,16
ADCIN_23: C43.1 R118.1 ; also sheet 4
GND: C43.2 C44.- C45.2 IC2.18(GNDB) IC2.19(GNDB) IC2.20(GNDB) IC2.26(GNDA) IC2.27(GNDA) IC2.28(GNDA) R114.1 ; also sheet 1,2,3,4,5,6,7,8,9,10,11,12,13,15,16
IC2_CS: IC2.9(CS) R114.2 R118.2
IC2_DIAGA: R112.1 ; also sheet 10
IC2_DIAGB: R113.1 ; also sheet 10
IC2_INA: R110.1 ; also sheet 10
IC2_INB: R111.1 ; also sheet 10
IC2_OUTA: IC2.1(OUTA) IC2.25(OUTA) IC2.30(OUTA) IC2.OUTA IC2.OUTA@1(OUTA) J3.2
IC2_OUTB: IC2.15(OUTB) IC2.16(OUTB) IC2.21(OUTB) IC2.OUTB IC2.OUTB@1(OUTB) J3.1
IC2_PWM: R117.1 ; also sheet 10
R110_IC2: IC2.5(INA) R110.2
R111_IC2: IC2.11(INB) R111.2
R112_IC1: IC2.6(DIAGA) R112.2 R115.1
R113_IC2: IC2.10(DIAGB) R113.2 R116.1
R117_IC2: IC2.8(PWM) R117.2

### Notes on the sheet
- H-bridge 2

## Sheet 15 of 16
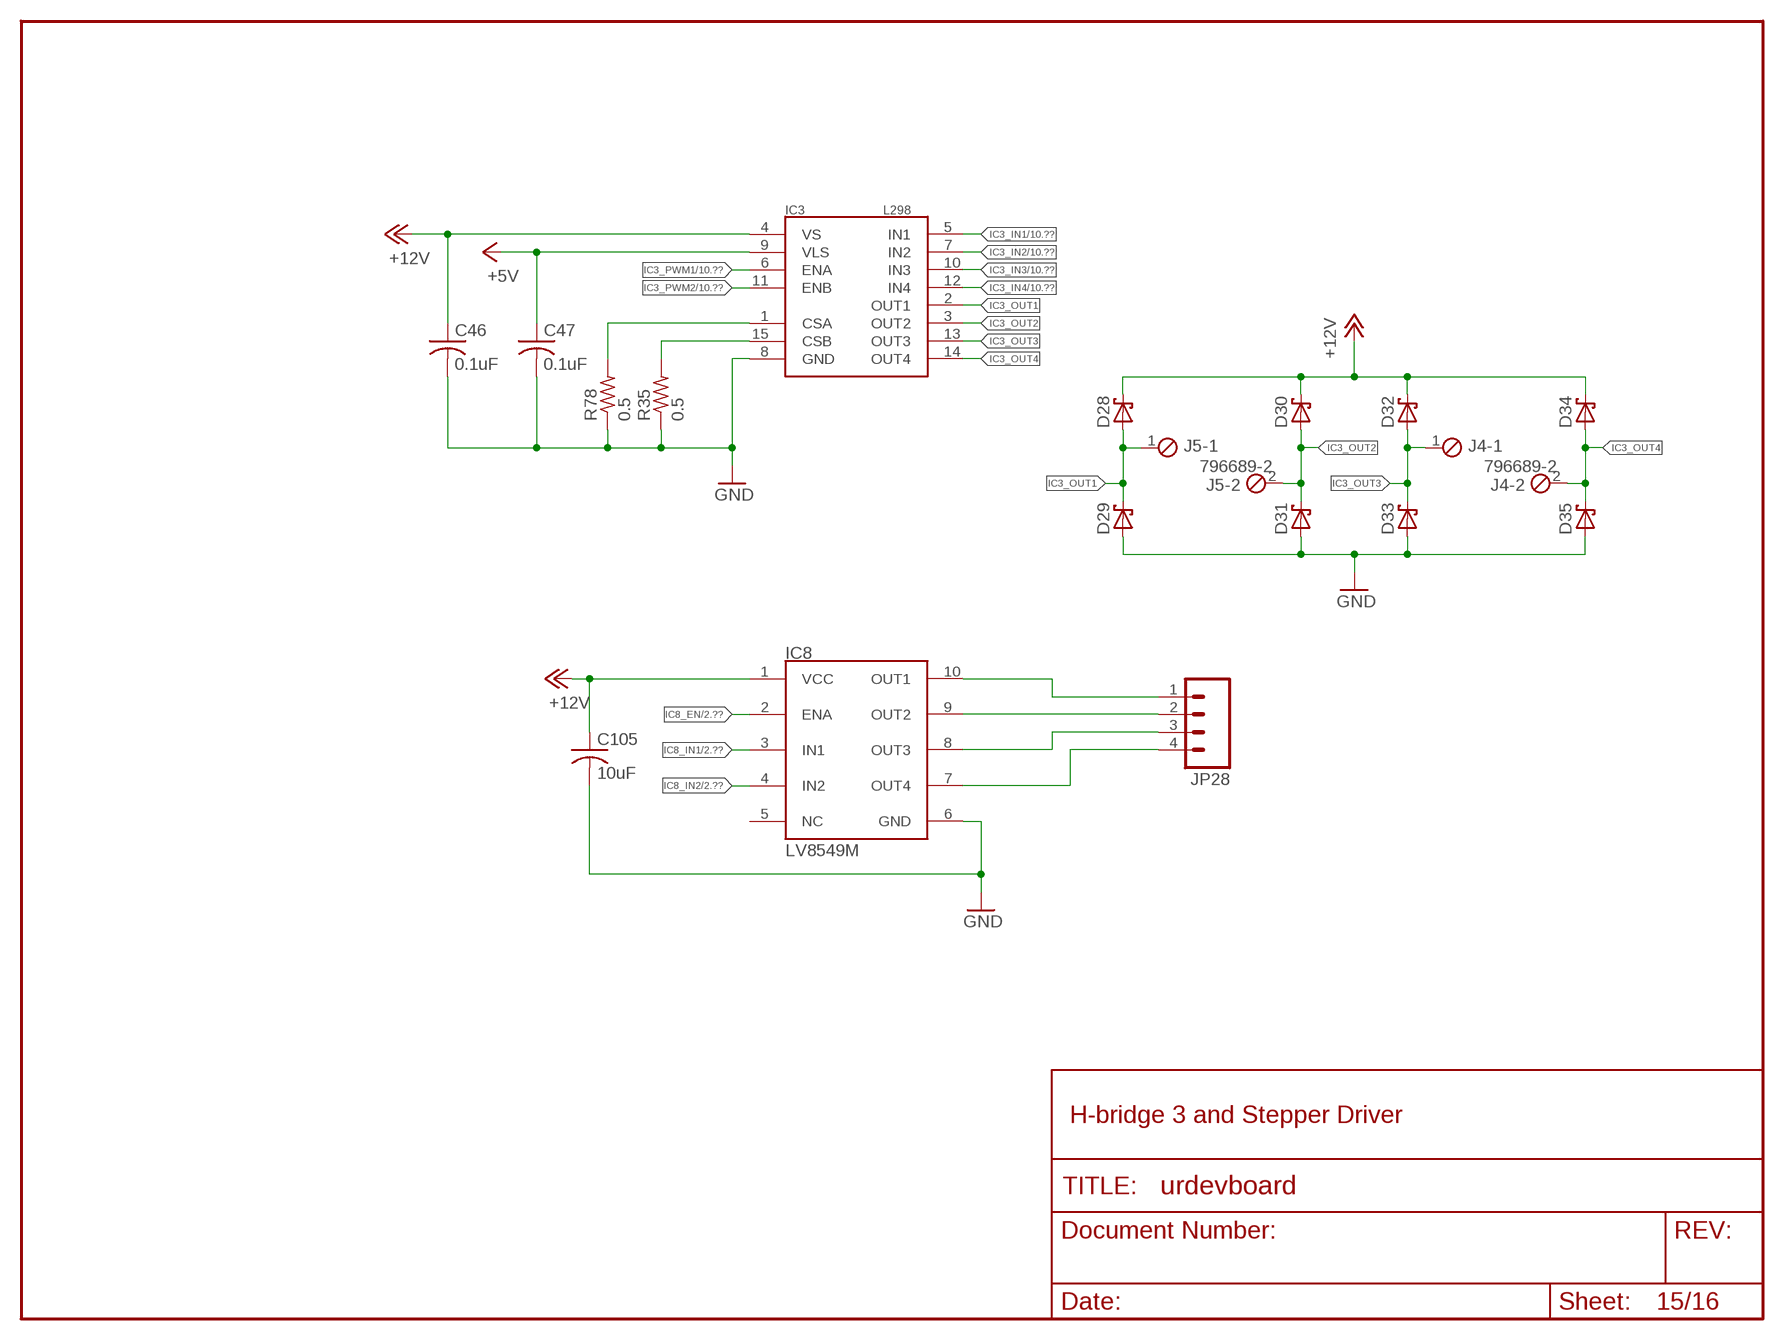
[diagram p14: schematic, sheet 15]

### Parts
C46  0.1uF  C-USC0603  [C0603]
C47  0.1uF  C-USC0603  [C0603]
C105  10uF  C-USC0805  [C0805]
D28  SCHOTTKY-DIODESOD128  [SOD128]
D29  SCHOTTKY-DIODESOD128  [SOD128]
D30  SCHOTTKY-DIODESOD128  [SOD128]
D31  SCHOTTKY-DIODESOD128  [SOD128]
D32  SCHOTTKY-DIODESOD128  [SOD128]
D33  SCHOTTKY-DIODESOD128  [SOD128]
D34  SCHOTTKY-DIODESOD128  [SOD128]
D35  SCHOTTKY-DIODESOD128  [SOD128]
IC3  L298  [MULTIWATT15]
IC8  LV8549M  [LSOP-10]
J4  796689-2  [796689-2]
J5  796689-2  [796689-2]
JP28  M04PTH  [1X04]
R35  0.5  R-US_R0805  [R0805]
R78  0.5  R-US_R0805  [R0805]

### Nets
+5V: C47.1 IC3.9(VLS) ; also sheet 3,4,6,7,8,10,12,13,14
+12V: C46.1 C105.1 D28.C D30.C D32.C D34.C IC3.4(VS) IC8.1(VCC) ; also sheet 7,8,13,14,16
ADCIN_9: IC3.15(CSB) R35.2 ; also sheet 4
ADCIN_24: IC3.1(CSA) R78.2 ; also sheet 4
GND: C46.2 C47.2 C105.2 D29.A D31.A D33.A D35.A IC3.8(GND) IC8.6(GND) R35.1 R78.1 ; also sheet 1,2,3,4,5,6,7,8,9,10,11,12,13,14,16
IC3_IN1: IC3.5(IN1) ; also sheet 10
IC3_IN2: IC3.7(IN2) ; also sheet 10
IC3_IN3: IC3.10(IN3) ; also sheet 10
IC3_IN4: IC3.12(IN4) ; also sheet 10
IC3_OUT1: D28.A D29.C IC3.2(OUT1) J5.1
IC3_OUT2: D30.A D31.C IC3.3(OUT2) J5.2
IC3_OUT3: D32.A D33.C IC3.13(OUT3) J4.1
IC3_OUT4: D34.A D35.C IC3.14(OUT4) J4.2
IC3_PWM1: IC3.6(ENA) ; also sheet 10
IC3_PWM2: IC3.11(ENB) ; also sheet 10
IC8_EN: IC8.2(ENA) ; also sheet 2
IC8_IN1: IC8.3(IN1) ; also sheet 2
IC8_IN2: IC8.4(IN2) ; also sheet 2
IC8_OUT1: IC8.10(OUT1) JP28.1
IC8_OUT2: IC8.9(OUT2) JP28.2
IC8_OUT3: IC8.8(OUT3) JP28.3
IC8_OUT4: IC8.7(OUT4) JP28.4
Unconnected: IC8.5(NC)

### Notes on the sheet
- H-bridge 3 and Stepper Driver